# EAGLE schematic microBoard (EAGLE 6.2)

## Sheet 1 of 8: Power supplies
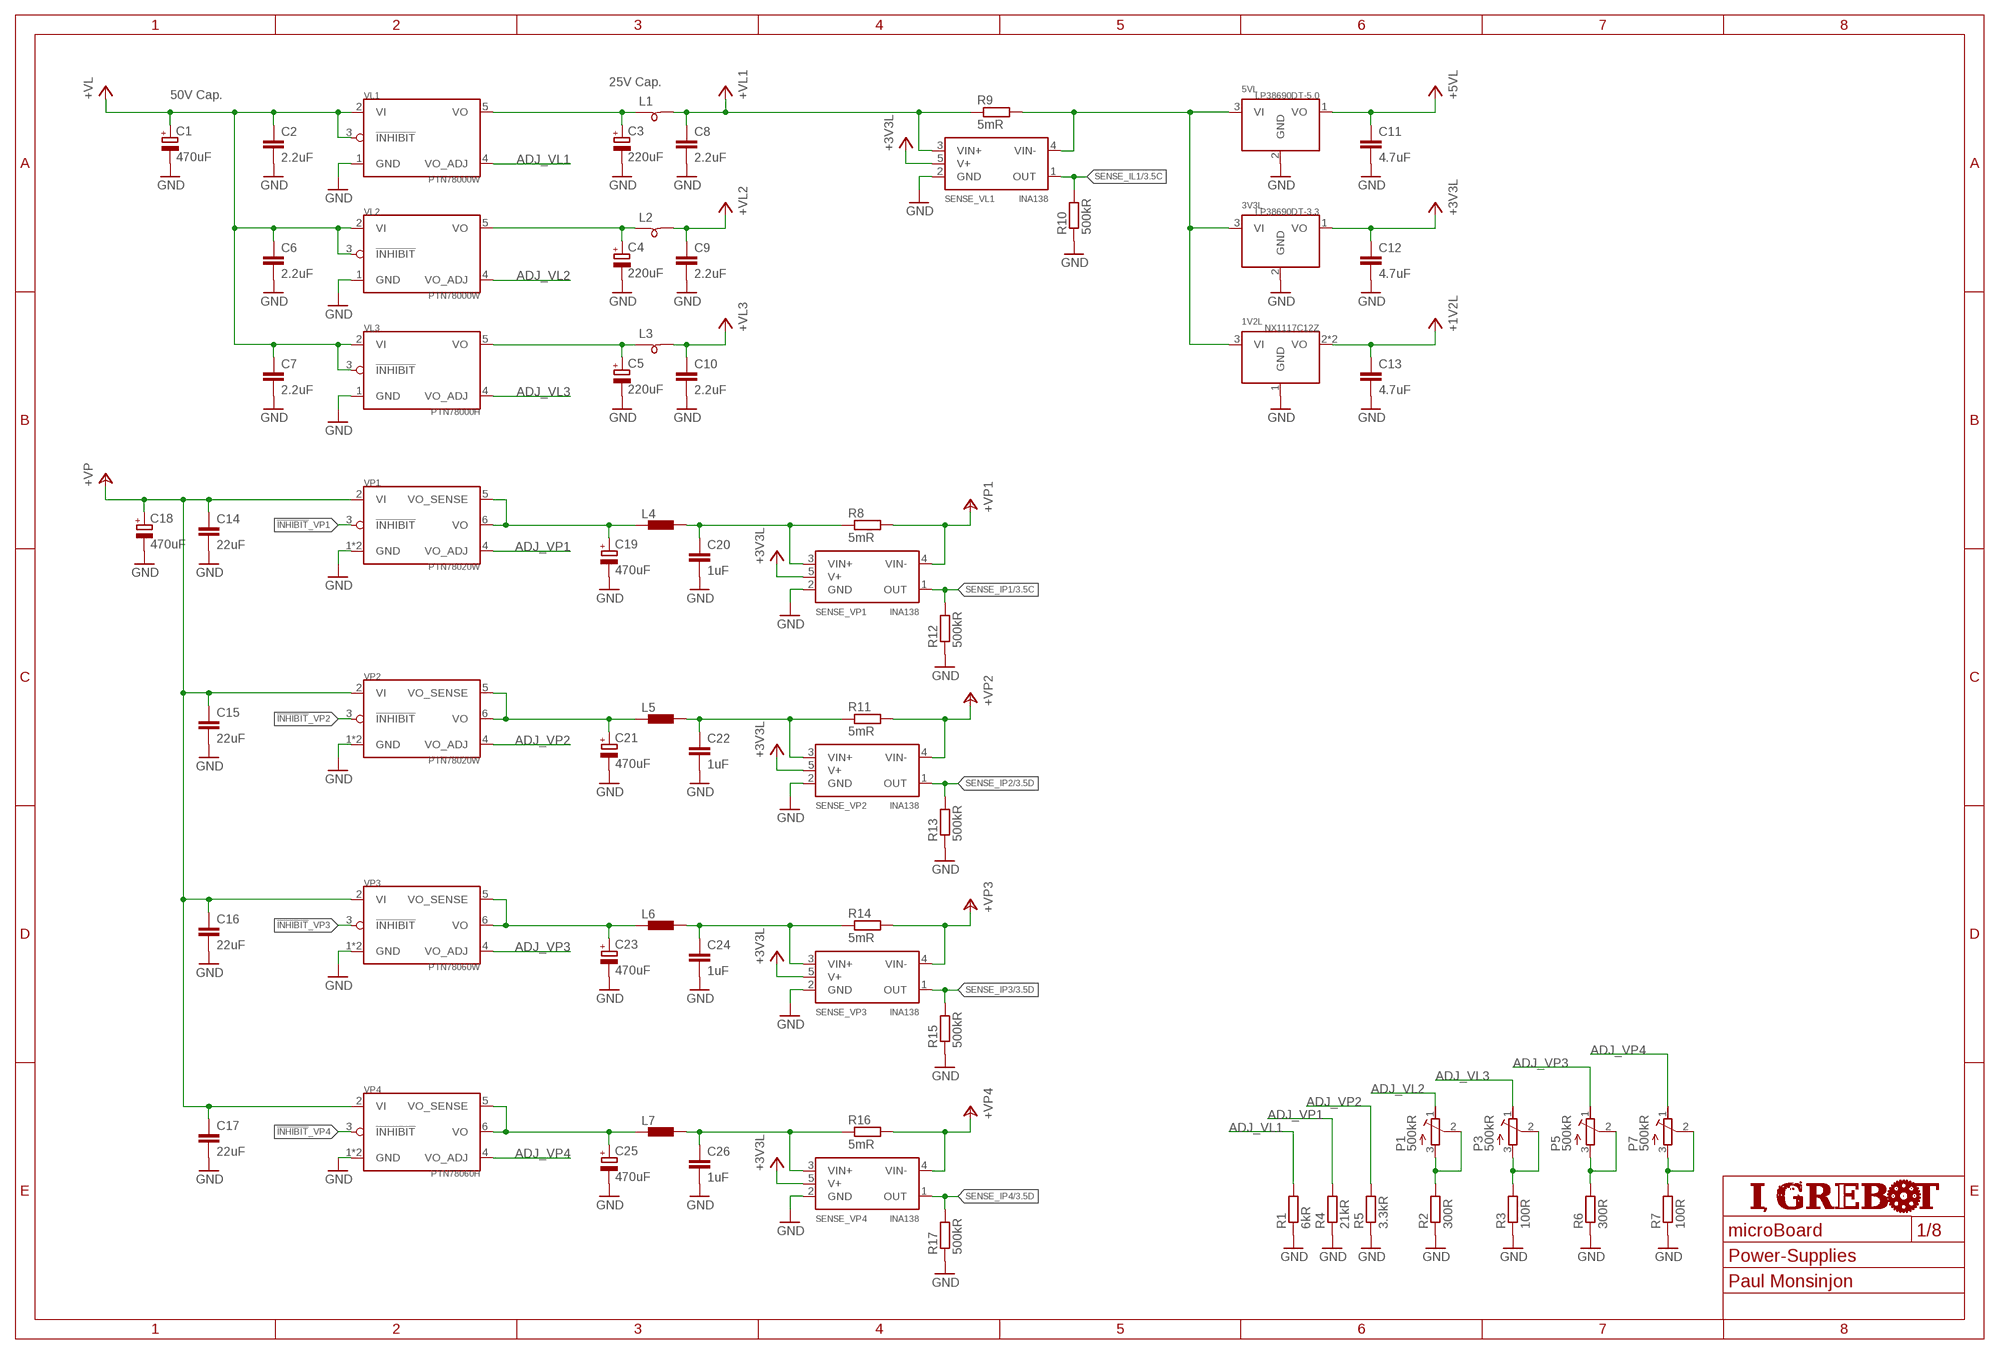
[diagram p0: schematic, sheet 1]
POWER-SUPPLIES (FRAME_A3): AUTHOR: Paul Monsinjon; SHEET_NAME: Power-Supplies

### Parts
1V2L  NX1117C12Z  NX1117C  [SOT_223]
3V3L  LP38690DT-3.3  LP38690DT  [NDP_0003B]
5VL  LP38690DT-5.0  LP38690DT  [NDP_0003B]
C1  470uF  CPOL-EUB  [PANASONIC_B]
C2  2.2uF  C-EUC3225  [C3225]
C3  220uF  CPOL-EUB  [PANASONIC_B]
C4  220uF  CPOL-EUB  [PANASONIC_B]
C5  220uF  CPOL-EUB  [PANASONIC_B]
C6  2.2uF  C-EUC3225  [C3225]
C7  2.2uF  C-EUC3225  [C3225]
C8  2.2uF  C-EUC3225  [C3225]
C9  2.2uF  C-EUC3225  [C3225]
C10  2.2uF  C-EUC3225  [C3225]
C11  4.7uF  C-EUC3225  [C3225]
C12  4.7uF  C-EUC3225  [C3225]
C13  4.7uF  C-EUC3225  [C3225]
C14  22uF  C-EUC3225  [C3225]
C15  22uF  C-EUC3225  [C3225]
C16  22uF  C-EUC3225  [C3225]
C17  22uF  C-EUC3225  [C3225]
C18  470uF  CPOL-EUB  [PANASONIC_B]
C19  470uF  CPOL-EUD  [PANASONIC_D]
C20  1uF  C-EUC3225  [C3225]
C21  470uF  CPOL-EUD  [PANASONIC_D]
C22  1uF  C-EUC3225  [C3225]
C23  470uF  CPOL-EUD  [PANASONIC_D]
C24  1uF  C-EUC3225  [C3225]
C25  470uF  CPOL-EUD  [PANASONIC_D]
C26  1uF  C-EUC3225  [C3225]
L1  SM-B9  [SM-B9]
L2  SM-B9  [SM-B9]
L3  SM-B9  [SM-B9]
L4  DR1030  [DR1030]
L5  DR1030  [DR1030]
L6  DR1030  [DR1030]
L7  DR1030  [DR1030]
P1  500kR  R-TRIMMT93XB  [RTRIMT93XB]
P3  500kR  R-TRIMMT93XB  [RTRIMT93XB]
P5  500kR  R-TRIMMT93XB  [RTRIMT93XB]
P7  500kR  R-TRIMMT93XB  [RTRIMT93XB]
R1  6kR  R-EU_R0603  [R0603]
R2  300R  R-EU_R0603  [R0603]
R3  100R  R-EU_R0603  [R0603]
R4  21kR  R-EU_R0603  [R0603]
R5  3.3kR  R-EU_R0603  [R0603]
R6  300R  R-EU_R0603  [R0603]
R7  100R  R-EU_R0603  [R0603]
R8  5mR  R-EU_R2512  [R2512]
R9  5mR  R-EU_R2512  [R2512]
R10  500kR  R-EU_R0603  [R0603]
R11  5mR  R-EU_R2512  [R2512]
R12  500kR  R-EU_R0603  [R0603]
R13  500kR  R-EU_R0603  [R0603]
R14  5mR  R-EU_R2512  [R2512]
R15  500kR  R-EU_R0603  [R0603]
R16  5mR  R-EU_R2512  [R2512]
R17  500kR  R-EU_R0603  [R0603]
SENSE_VL1  INA138  [DBV_05]
SENSE_VP1  INA138  [DBV_05]
SENSE_VP2  INA138  [DBV_05]
SENSE_VP3  INA138  [DBV_05]
SENSE_VP4  INA138  [DBV_05]
VL1  PTN78000W  [PTN78000]
VL2  PTN78000W  [PTN78000]
VL3  PTN78000H  PTN78000W  [PTN78000]
VP1  PTN78020W  [PTN78020]
VP2  PTN78020W  [PTN78020]
VP3  PTN78060W  [PTN78060]
VP4  PTN78060H  PTN78060W  [PTN78060]

### Nets
!INHIBIT!_VP1: VP1.3(!INHIBIT!)
!INHIBIT!_VP2: VP2.3(!INHIBIT!)
!INHIBIT!_VP3: VP3.3(!INHIBIT!)
!INHIBIT!_VP4: VP4.3(!INHIBIT!)
+1V2L: 1V2L.2(VO) 1V2L.4(VO) C13.1 ; also sheet 4
+3V3L: 3V3L.1(VO) C12.1 SENSE_VL1.5(V+) SENSE_VP1.5(V+) SENSE_VP2.5(V+) SENSE_VP3.5(V+) SENSE_VP4.5(V+) ; also sheet 2,3,4,5,6,7
+5VL: 5VL.1(VO) C11.1 ; also sheet 2
+VL: C1.+ C2.1 C6.1 C7.1 VL1.2(VI) VL1.3(!INHIBIT!) VL2.2(VI) VL2.3(!INHIBIT!) VL3.2(VI) VL3.3(!INHIBIT!)
+VL1: C8.1 L1.2 R9.1 SENSE_VL1.3(VIN+)
+VL2: C9.1 L2.2 ; also sheet 2
+VL3: C10.1 L3.2
+VP: C14.1 C15.1 C16.1 C17.1 C18.+ VP1.2(VI) VP2.2(VI) VP3.2(VI) VP4.2(VI) ; also sheet 5
+VP1: R8.2 SENSE_VP1.4(VIN-) ; also sheet 7
+VP2: R11.2 SENSE_VP2.4(VIN-)
+VP3: R14.2 SENSE_VP3.4(VIN-) ; also sheet 5
+VP4: R16.2 SENSE_VP4.4(VIN-) ; also sheet 5
ADJ_VL1: R1.2 VL1.4(VO_ADJ)
ADJ_VL2: P1.1(A) VL2.4(VO_ADJ)
ADJ_VL3: P3.1(A) VL3.4(VO_ADJ)
ADJ_VP1: R4.2 VP1.4(VO_ADJ)
ADJ_VP2: R5.2 VP2.4(VO_ADJ)
ADJ_VP3: P5.1(A) VP3.4(VO_ADJ)
ADJ_VP4: P7.1(A) VP4.4(VO_ADJ)
GND: 1V2L.1(GND) 3V3L.2(GND) 5VL.2(GND) C1.- C2.2 C3.- C4.- C5.- C6.2 C7.2 C8.2 C9.2 C10.2 C11.2 C12.2 C13.2 C14.2 C15.2 C16.2 C17.2 C18.- C19.- C20.2 C21.- C22.2 C23.- C24.2 C25.- C26.2 R1.1 R2.1 R3.1 R4.1 R5.1 R6.1 R7.1 R10.1 R12.1 R13.1 R15.1 R17.1 SENSE_VL1.2(GND) SENSE_VP1.2(GND) SENSE_VP2.2(GND) SENSE_VP3.2(GND) SENSE_VP4.2(GND) VL1.1(GND) VL2.1(GND) VL3.1(GND) VP1.1(GND) VP1.7(GND) VP2.1(GND) VP2.7(GND) VP3.1(GND) VP3.7(GND) VP4.1(GND) VP4.7(GND) ; also sheet 2,3,4,5,6,7
N$1: C19.+ L4.1 VP1.5(VO_SENSE) VP1.6(VO)
N$2: P1.2(S) P1.3(E) R2.2
N$3: C20.1 L4.2 R8.1 SENSE_VP1.3(VIN+)
N$4: P3.2(S) P3.3(E) R3.2
N$6: P5.2(S) P5.3(E) R6.2
N$7: C21.+ L5.1 VP2.5(VO_SENSE) VP2.6(VO)
N$8: C3.+ L1.1 VL1.5(VO)
N$9: C4.+ L2.1 VL2.5(VO)
N$10: C5.+ L3.1 VL3.5(VO)
N$11: P7.2(S) P7.3(E) R7.2
N$12: C22.1 L5.2 R11.1 SENSE_VP2.3(VIN+)
N$13: C23.+ L6.1 VP3.5(VO_SENSE) VP3.6(VO)
N$14: C24.1 L6.2 R14.1 SENSE_VP3.3(VIN+)
N$15: C25.+ L7.1 VP4.5(VO_SENSE) VP4.6(VO)
N$16: C26.1 L7.2 R16.1 SENSE_VP4.3(VIN+)
SENSE_IL1: R10.2 SENSE_VL1.1(OUT) ; also sheet 3
SENSE_IP1: R12.2 SENSE_VP1.1(OUT) ; also sheet 3
SENSE_IP2: R13.2 SENSE_VP2.1(OUT) ; also sheet 3
SENSE_IP3: R15.2 SENSE_VP3.1(OUT) ; also sheet 3
SENSE_IP4: R17.2 SENSE_VP4.1(OUT) ; also sheet 3
VS1: 1V2L.3(VI) 3V3L.3(VI) 5VL.3(VI) R9.2 SENSE_VL1.4(VIN-)

### Notes on the sheet
- 25V Cap.
- 50V Cap.

## Sheet 2 of 8: Connectors & User-Interface
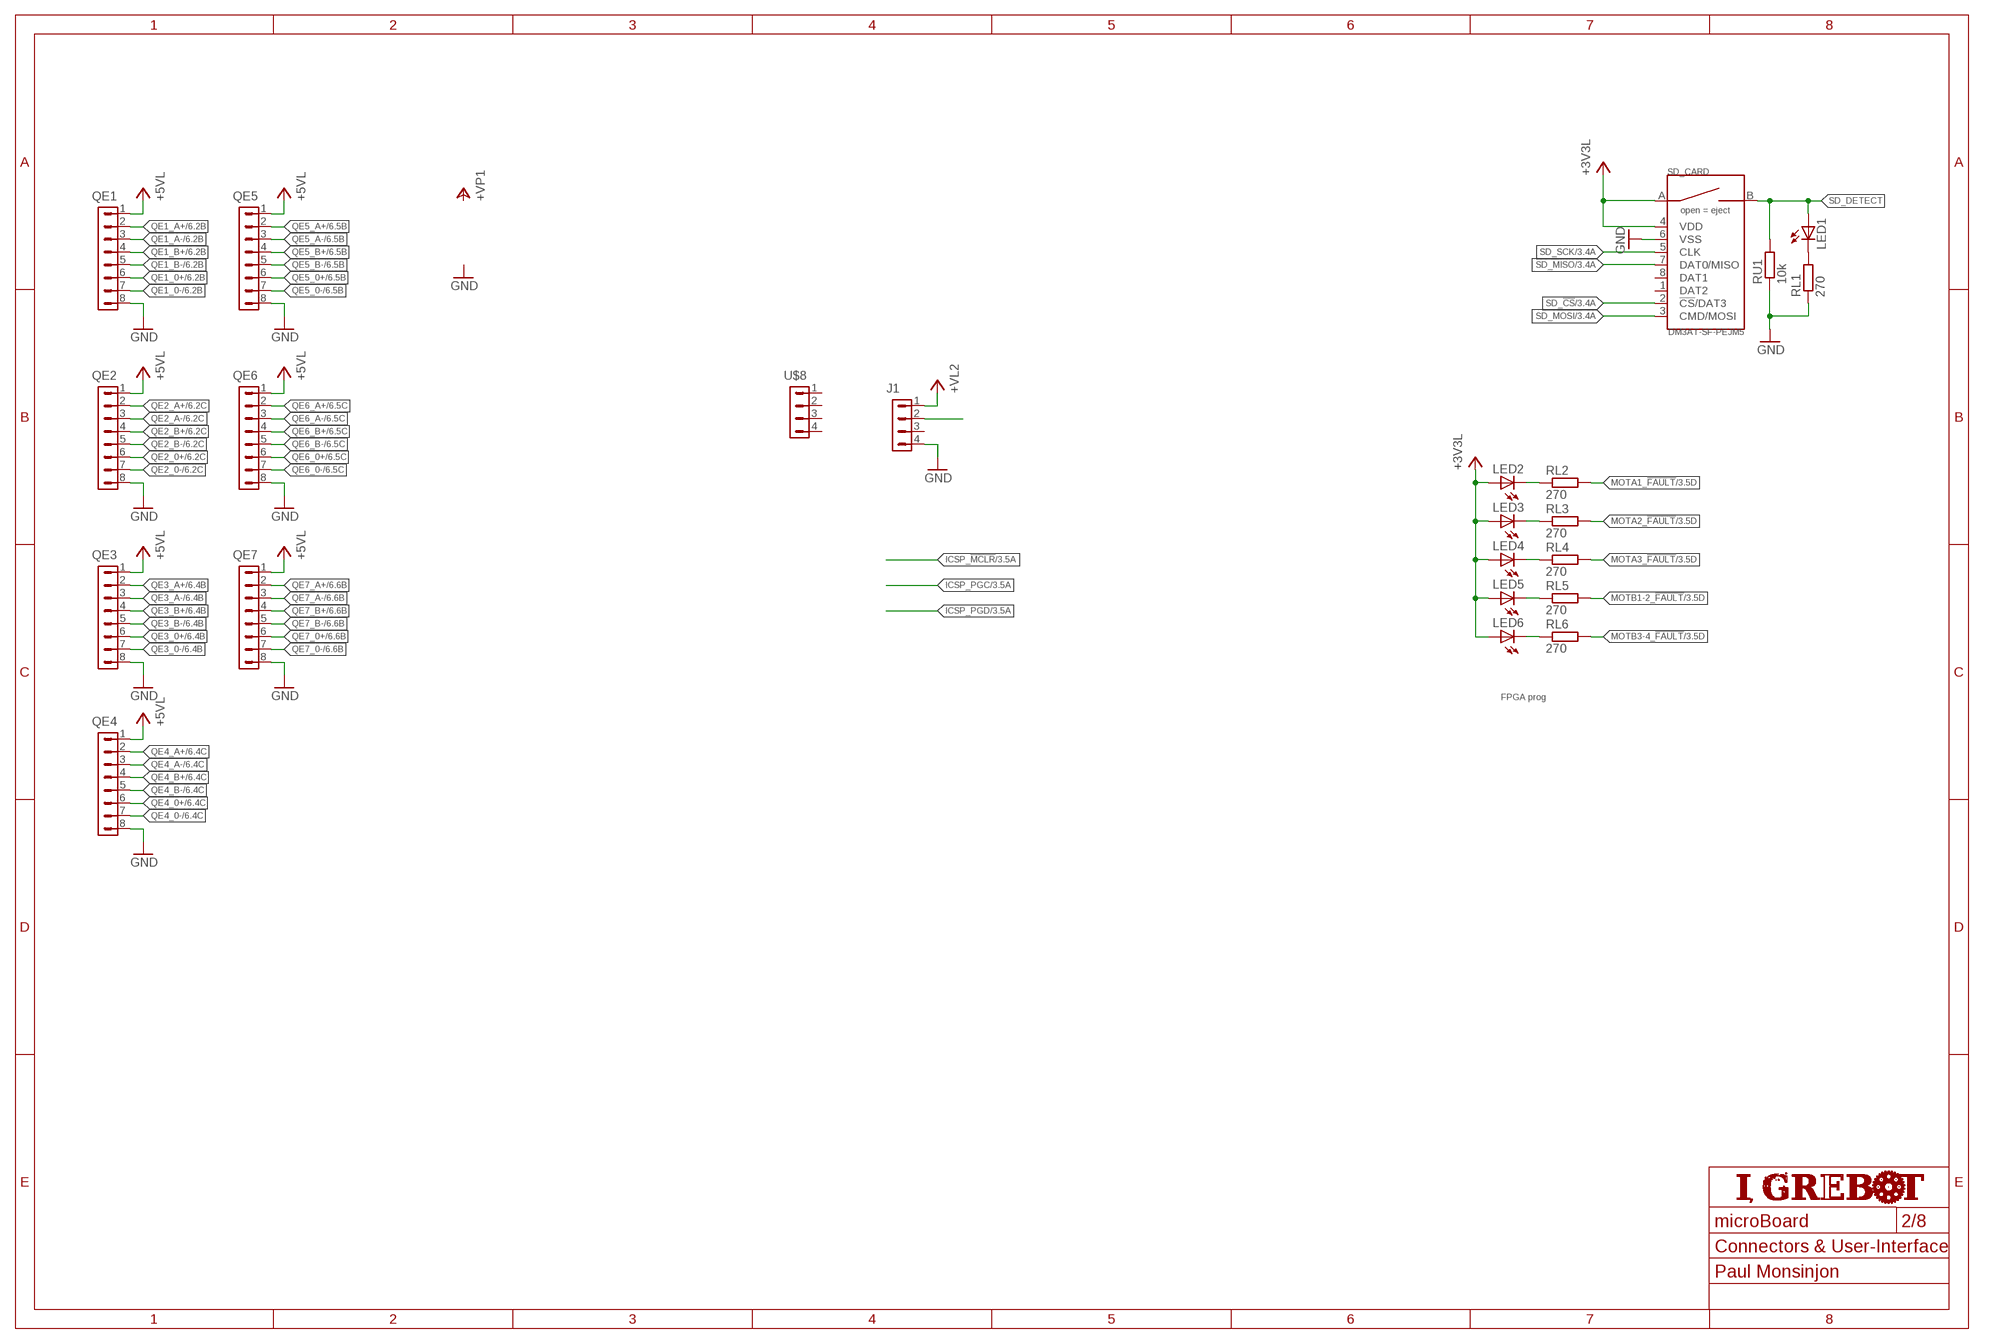
[diagram p1: schematic, sheet 2]
U$4 (FRAME_A3): AUTHOR: Paul Monsinjon; SHEET_NAME: Connectors & User-Interface

### Parts
J1  CON_1.27_4  [CON_1.27_4]
LED1  LEDCHIP-LED0805  [CHIP-LED0805]
LED2  LEDCHIP-LED0805  [CHIP-LED0805]
LED3  LEDCHIP-LED0805  [CHIP-LED0805]
LED4  LEDCHIP-LED0805  [CHIP-LED0805]
LED5  LEDCHIP-LED0805  [CHIP-LED0805]
LED6  LEDCHIP-LED0805  [CHIP-LED0805]
QE1  CON_1.27_8  [CON_1.27_8]
QE2  CON_1.27_8  [CON_1.27_8]
QE3  CON_1.27_8  [CON_1.27_8]
QE4  CON_1.27_8  [CON_1.27_8]
QE5  CON_1.27_8  [CON_1.27_8]
QE6  CON_1.27_8  [CON_1.27_8]
QE7  CON_1.27_8  [CON_1.27_8]
RL1  270  R-EU_R0603  [R0603]
RL2  270  R-EU_R0603  [R0603]
RL3  270  R-EU_R0603  [R0603]
RL4  270  R-EU_R0603  [R0603]
RL5  270  R-EU_R0603  [R0603]
RL6  270  R-EU_R0603  [R0603]
RU1  10k  R-EU_R0603  [R0603]
SD_CARD  DM3AT-SF-PEJM5  [DM3AT]
U$8  CON_1.25_4  [CON_1.25_4]

### Nets
+3V3L: LED2.A LED3.A LED4.A LED5.A LED6.A SD_CARD.4(VDD) SD_CARD.A ; also sheet 1,3,4,5,6,7
+5VL: QE1.1 QE2.1 QE3.1 QE4.1 QE5.1 QE6.1 QE7.1 ; also sheet 1
+VL2: J1.1 ; also sheet 1
GND: J1.4 QE1.8 QE2.8 QE3.8 QE4.8 QE5.8 QE6.8 QE7.8 RL1.1 RU1.1 SD_CARD.6(VSS) ; also sheet 1,3,4,5,6,7
MOTA1_!FAULT!: RL2.2 ; also sheet 3,5
MOTA2_!FAULT!: RL3.2 ; also sheet 3,5
MOTA3_!FAULT!: RL4.2 ; also sheet 3,5
MOTB1-2_!FAULT!: RL5.2 ; also sheet 3,5
MOTB3-4_!FAULT!: RL6.2 ; also sheet 3,5
N$17: LED1.C RL1.2
N$37: LED2.C RL2.1
N$39: LED3.C RL3.1
N$40: LED4.C RL4.1
N$41: LED5.C RL5.1
N$42: LED6.C RL6.1
N$51: J1.2
QE1_0+: QE1.6 ; also sheet 6
QE1_0-: QE1.7 ; also sheet 6
QE1_A+: QE1.2 ; also sheet 6
QE1_A-: QE1.3 ; also sheet 6
QE1_B+: QE1.4 ; also sheet 6
QE1_B-: QE1.5 ; also sheet 6
QE2_0+: QE2.6 ; also sheet 6
QE2_0-: QE2.7 ; also sheet 6
QE2_A+: QE2.2 ; also sheet 6
QE2_A-: QE2.3 ; also sheet 6
QE2_B+: QE2.4 ; also sheet 6
QE2_B-: QE2.5 ; also sheet 6
QE3_0+: QE3.6 ; also sheet 6
QE3_0-: QE3.7 ; also sheet 6
QE3_A+: QE3.2 ; also sheet 6
QE3_A-: QE3.3 ; also sheet 6
QE3_B+: QE3.4 ; also sheet 6
QE3_B-: QE3.5 ; also sheet 6
QE4_0+: QE4.6 ; also sheet 6
QE4_0-: QE4.7 ; also sheet 6
QE4_A+: QE4.2 ; also sheet 6
QE4_A-: QE4.3 ; also sheet 6
QE4_B+: QE4.4 ; also sheet 6
QE4_B-: QE4.5 ; also sheet 6
QE5_0+: QE5.6 ; also sheet 6
QE5_0-: QE5.7 ; also sheet 6
QE5_A+: QE5.2 ; also sheet 6
QE5_A-: QE5.3 ; also sheet 6
QE5_B+: QE5.4 ; also sheet 6
QE5_B-: QE5.5 ; also sheet 6
QE6_0+: QE6.6 ; also sheet 6
QE6_0-: QE6.7 ; also sheet 6
QE6_A+: QE6.2 ; also sheet 6
QE6_A-: QE6.3 ; also sheet 6
QE6_B+: QE6.4 ; also sheet 6
QE6_B-: QE6.5 ; also sheet 6
QE7_0+: QE7.6 ; also sheet 6
QE7_0-: QE7.7 ; also sheet 6
QE7_A+: QE7.2 ; also sheet 6
QE7_A-: QE7.3 ; also sheet 6
QE7_B+: QE7.4 ; also sheet 6
QE7_B-: QE7.5 ; also sheet 6
SD_!CS!: SD_CARD.2(!CS!/DAT3) ; also sheet 3
SD_DETECT: LED1.A RU1.2 SD_CARD.B
SD_MISO: SD_CARD.7(DAT0/MISO) ; also sheet 3
SD_MOSI: SD_CARD.3(CMD/MOSI) ; also sheet 3
SD_SCK: SD_CARD.5(CLK) ; also sheet 3
Unconnected: J1.3 SD_CARD.1(DAT2) SD_CARD.8(DAT1) U$8.1 U$8.2 U$8.3 U$8.4

### Notes on the sheet
- FPGA prog

## Sheet 3 of 8: µC dsPIC33E
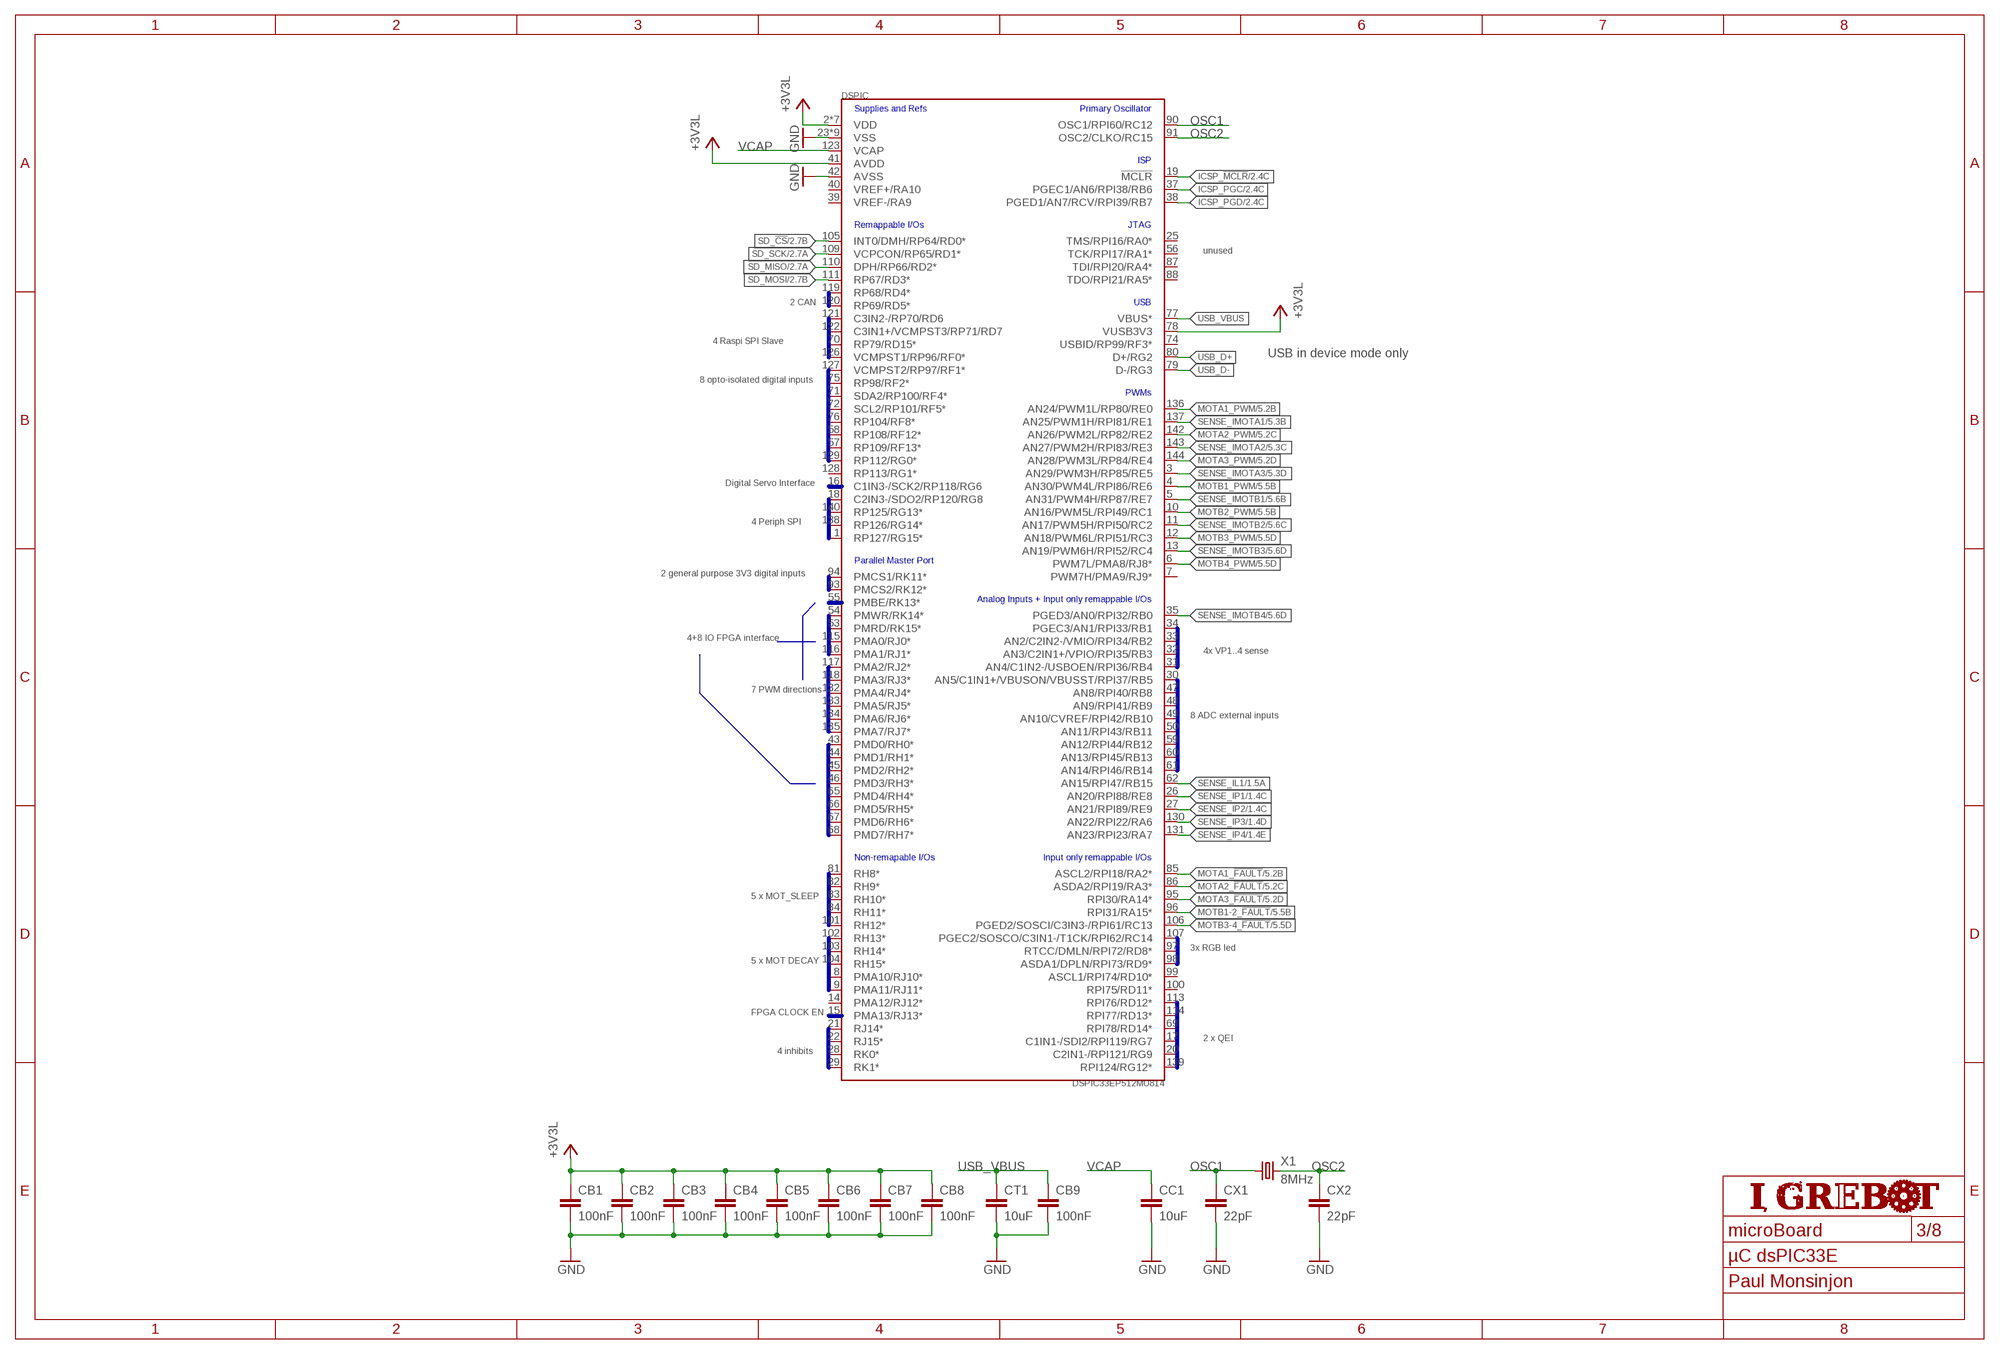
[diagram p2: schematic, sheet 3]
U$2 (FRAME_A3): AUTHOR: Paul Monsinjon; SHEET_NAME: µC dsPIC33E

### Parts
CB1  100nF  C-EUC0603  [C0603]
CB2  100nF  C-EUC0603  [C0603]
CB3  100nF  C-EUC0603  [C0603]
CB4  100nF  C-EUC0603  [C0603]
CB5  100nF  C-EUC0603  [C0603]
CB6  100nF  C-EUC0603  [C0603]
CB7  100nF  C-EUC0603  [C0603]
CB8  100nF  C-EUC0603  [C0603]
CB9  100nF  C-EUC0603  [C0603]
CC1  10uF  C-EUC1210  [C1210]
CT1  10uF  C-EUC1210  [C1210]
CX1  22pF  C-EUC0603  [C0603]
CX2  22pF  C-EUC0603  [C0603]
DSPIC  DSPIC33EP512MU814  [TQFP_144]
X1  8MHz  CRYSTALCTS406  [CTS406]

### Nets
+3V3L: CB1.1 CB2.1 CB3.1 CB4.1 CB5.1 CB6.1 CB7.1 CB8.1 DSPIC.2(VDD) DSPIC.24(VDD) DSPIC.41(AVDD) DSPIC.52(VDD) DSPIC.64(VDD) DSPIC.78(VUSB3V3) DSPIC.89(VDD) DSPIC.112(VDD) DSPIC.124(VDD) ; also sheet 1,2,4,5,6,7
GND: CB1.2 CB2.2 CB3.2 CB4.2 CB5.2 CB6.2 CB7.2 CB8.2 CB9.2 CC1.2 CT1.2 CX1.2 CX2.2 DSPIC.23(VSS) DSPIC.36(VSS) DSPIC.42(AVSS) DSPIC.51(VSS) DSPIC.63(VSS) DSPIC.73(VSS) DSPIC.92(VSS) DSPIC.108(VSS) DSPIC.125(VSS) DSPIC.141(VSS) ; also sheet 1,2,4,5,6,7
ICSP_!MCLR!: DSPIC.19(!MCLR!) ; also sheet 2
ICSP_PGC: DSPIC.37(PGEC1/AN6/RPI38/RB6) ; also sheet 2
ICSP_PGD: DSPIC.38(PGED1/AN7/RCV/RPI39/RB7) ; also sheet 2
MOTA1_!FAULT!: DSPIC.85(ASCL2/RPI18/RA2*) ; also sheet 2,5
MOTA1_PWM: DSPIC.136(AN24/PWM1L/RP80/RE0) ; also sheet 5
MOTA2_!FAULT!: DSPIC.86(ASDA2/RPI19/RA3*) ; also sheet 2,5
MOTA2_PWM: DSPIC.142(AN26/PWM2L/RP82/RE2) ; also sheet 5
MOTA3_!FAULT!: DSPIC.95(RPI30/RA14*) ; also sheet 2,5
MOTA3_PWM: DSPIC.144(AN28/PWM3L/RP84/RE4) ; also sheet 5
MOTB1-2_!FAULT!: DSPIC.96(RPI31/RA15*) ; also sheet 2,5
MOTB1_PWM: DSPIC.4(AN30/PWM4L/RPI86/RE6) ; also sheet 5
MOTB2_PWM: DSPIC.10(AN16/PWM5L/RPI49/RC1) ; also sheet 5
MOTB3-4_!FAULT!: DSPIC.106(PGED2/SOSCI/C3IN3-/RPI61/RC13) ; also sheet 2,5
MOTB3_PWM: DSPIC.12(AN18/PWM6L/RPI51/RC3) ; also sheet 5
MOTB4_PWM: DSPIC.6(PWM7L/PMA8/RJ8*) ; also sheet 5
OSC1: CX1.1 DSPIC.90(OSC1/RPI60/RC12) X1.1
OSC2: CX2.1 DSPIC.91(OSC2/CLKO/RC15) X1.3
SD_!CS!: DSPIC.105(INT0/DMH/RP64/RD0*) ; also sheet 2
SD_MISO: DSPIC.110(DPH/RP66/RD2*) ; also sheet 2
SD_MOSI: DSPIC.111(RP67/RD3*) ; also sheet 2
SD_SCK: DSPIC.109(VCPCON/RP65/RD1*) ; also sheet 2
SENSE_IL1: DSPIC.62(AN15/RPI47/RB15) ; also sheet 1
SENSE_IMOTA1: DSPIC.137(AN25/PWM1H/RPI81/RE1) ; also sheet 5
SENSE_IMOTA2: DSPIC.143(AN27/PWM2H/RPI83/RE3) ; also sheet 5
SENSE_IMOTA3: DSPIC.3(AN29/PWM3H/RP85/RE5) ; also sheet 5
SENSE_IMOTB1: DSPIC.5(AN31/PWM4H/RP87/RE7) ; also sheet 5
SENSE_IMOTB2: DSPIC.11(AN17/PWM5H/RPI50/RC2) ; also sheet 5
SENSE_IMOTB3: DSPIC.13(AN19/PWM6H/RPI52/RC4) ; also sheet 5
SENSE_IMOTB4: DSPIC.35(PGED3/AN0/RPI32/RB0) ; also sheet 5
SENSE_IP1: DSPIC.26(AN20/RPI88/RE8) ; also sheet 1
SENSE_IP2: DSPIC.27(AN21/RPI89/RE9) ; also sheet 1
SENSE_IP3: DSPIC.130(AN22/RPI22/RA6) ; also sheet 1
SENSE_IP4: DSPIC.131(AN23/RPI23/RA7) ; also sheet 1
USB_D+: DSPIC.80(D+/RG2)
USB_D-: DSPIC.79(D-/RG3)
USB_VBUS: CB9.1 CT1.1 DSPIC.77(VBUS*)
VCAP: CC1.1 DSPIC.123(VCAP)
Unconnected: DSPIC.1(RP127/RG15*) DSPIC.7(PWM7H/PMA9/RJ9*) DSPIC.8(PMA10/RJ10*) DSPIC.9(PMA11/RJ11*) DSPIC.14(PMA12/RJ12*) DSPIC.15(PMA13/RJ13*) DSPIC.16(C1IN3-/SCK2/RP118/RG6) DSPIC.17(C1IN1-/SDI2/RPI119/RG7) DSPIC.18(C2IN3-/SDO2/RP120/RG8) DSPIC.20(C2IN1-/RPI121/RG9) DSPIC.21(RJ14*) DSPIC.22(RJ15*) DSPIC.25(TMS/RPI16/RA0*) DSPIC.28(RK0*) DSPIC.29(RK1*) DSPIC.30(AN5/C1IN1+/VBUSON/VBUSST/RPI37/RB5) DSPIC.31(AN4/C1IN2-/USBOEN/RPI36/RB4) DSPIC.32(AN3/C2IN1+/VPIO/RPI35/RB3) DSPIC.33(AN2/C2IN2-/VMIO/RPI34/RB2) DSPIC.34(PGEC3/AN1/RPI33/RB1) DSPIC.39(VREF-/RA9) DSPIC.40(VREF+/RA10) DSPIC.43(PMD0/RH0*) DSPIC.44(PMD1/RH1*) DSPIC.45(PMD2/RH2*) DSPIC.46(PMD3/RH3*) DSPIC.47(AN8/RPI40/RB8) DSPIC.48(AN9/RPI41/RB9) DSPIC.49(AN10/CVREF/RPI42/RB10) DSPIC.50(AN11/RPI43/RB11) DSPIC.53(PMRD/RK15*) DSPIC.54(PMWR/RK14*) DSPIC.55(PMBE/RK13*) DSPIC.56(TCK/RPI17/RA1*) DSPIC.57(RP109/RF13*) DSPIC.58(RP108/RF12*) DSPIC.59(AN12/RPI44/RB12) DSPIC.60(AN13/RPI45/RB13) DSPIC.61(AN14/RPI46/RB14) DSPIC.65(PMD4/RH4*) DSPIC.66(PMD5/RH5*) DSPIC.67(PMD6/RH6*) DSPIC.68(PMD7/RH7*) DSPIC.69(RPI78/RD14*) DSPIC.70(RP79/RD15*) DSPIC.71(SDA2/RP100/RF4*) DSPIC.72(SCL2/RP101/RF5*) DSPIC.74(USBID/RP99/RF3*) DSPIC.75(RP98/RF2*) DSPIC.76(RP104/RF8*) DSPIC.81(RH8*) DSPIC.82(RH9*) DSPIC.83(RH10*) DSPIC.84(RH11*) DSPIC.87(TDI/RPI20/RA4*) DSPIC.88(TDO/RPI21/RA5*) DSPIC.93(PMCS2/RK12*) DSPIC.94(PMCS1/RK11*) DSPIC.97(RTCC/DMLN/RPI72/RD8*) DSPIC.98(ASDA1/DPLN/RPI73/RD9*) DSPIC.99(ASCL1/RPI74/RD10*) DSPIC.100(RPI75/RD11*) DSPIC.101(RH12*) DSPIC.102(RH13*) DSPIC.103(RH14*) DSPIC.104(RH15*) DSPIC.107(PGEC2/SOSCO/C3IN1-/T1CK/RPI62/RC14) DSPIC.113(RPI76/RD12*) DSPIC.114(RPI77/RD13*) DSPIC.115(PMA0/RJ0*) DSPIC.116(PMA1/RJ1*) DSPIC.117(PMA2/RJ2*) DSPIC.118(PMA3/RJ3*) DSPIC.119(RP68/RD4*) DSPIC.120(RP69/RD5*) DSPIC.121(C3IN2-/RP70/RD6) DSPIC.122(C3IN1+/VCMPST3/RP71/RD7) DSPIC.126(VCMPST1/RP96/RF0*) DSPIC.127(VCMPST2/RP97/RF1*) DSPIC.128(RP113/RG1*) DSPIC.129(RP112/RG0*) DSPIC.132(PMA4/RJ4*) DSPIC.133(PMA5/RJ5*) DSPIC.134(PMA6/RJ6*) DSPIC.135(PMA7/RJ7*) DSPIC.138(RP126/RG14*) DSPIC.139(RPI124/RG12*) DSPIC.140(RP125/RG13*)

### Buses
B$3
B$5
B$8
B$9
B$11
B$12
B$13
B$14
B$16
B$6
B$17
B$18
B$10
B$19
B$7
B$15
B$20
B$21
B$22
B$23

### Notes on the sheet
- unused
- 2 CAN
- 4 Raspi SPI Slave
- USB in device mode only
- 8 opto-isolated digital inputs
- Digital Servo Interface
- 4 Periph SPI
- 2 general purpose 3V3 digital inputs
- 4+8 IO FPGA interface
- 4x VP1..4 sense
- 7 PWM directions
- 8 ADC external inputs
- 5 x MOT_SLEEP
- 3x RGB led
- 5 x MOT DECAY
- FPGA CLOCK EN
- 2 x QEI
- 4 inhibits

## Sheet 4 of 8: FPGA XC3S200A
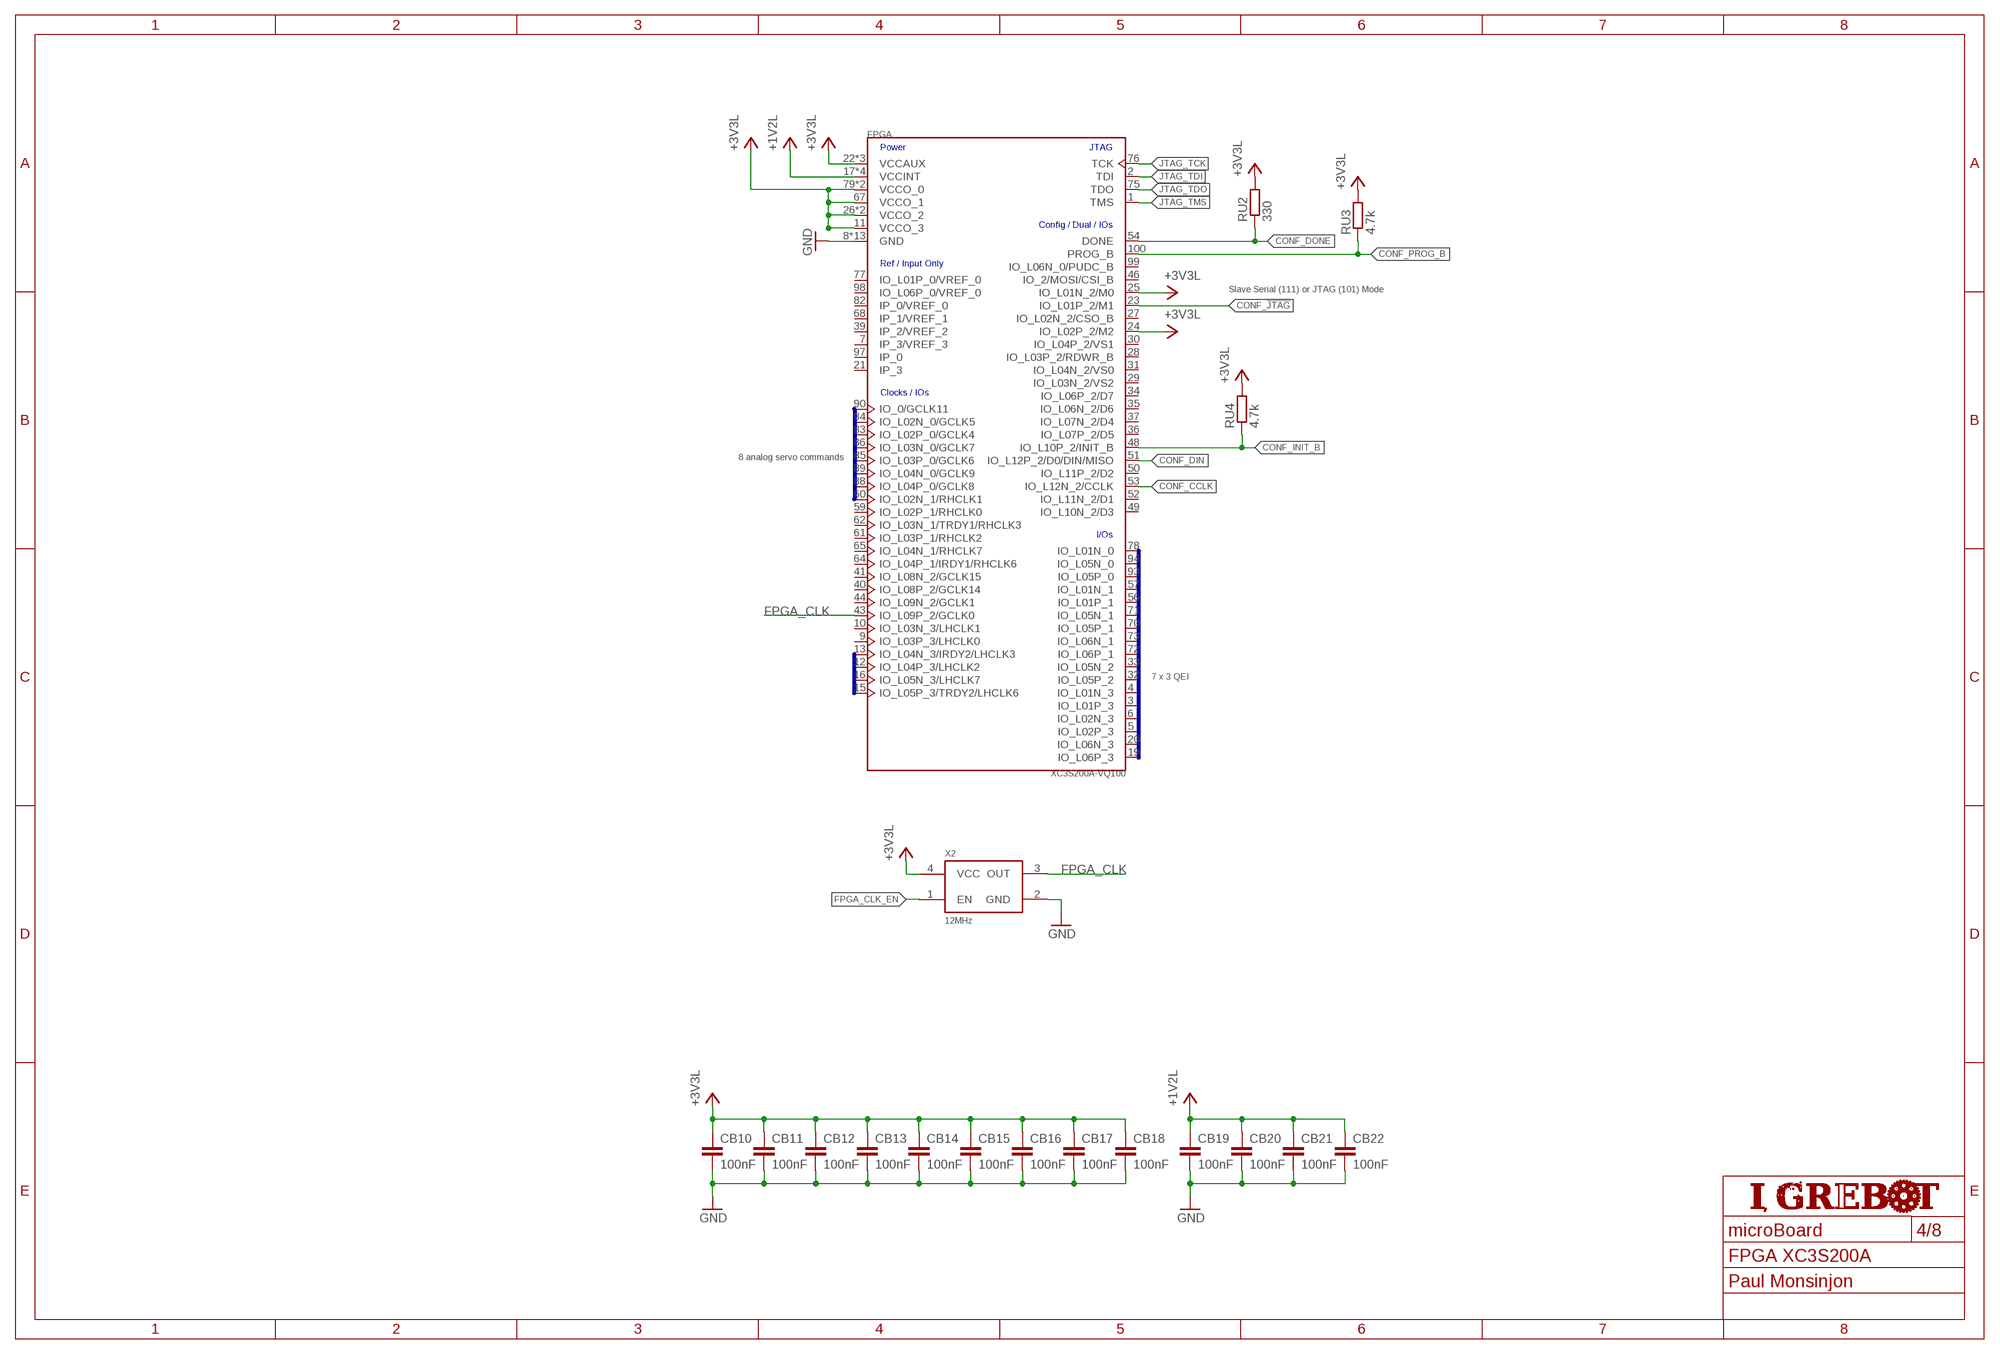
[diagram p3: schematic, sheet 4]
U$3 (FRAME_A3): AUTHOR: Paul Monsinjon; SHEET_NAME: FPGA XC3S200A

### Parts
CB10  100nF  C-EUC0603  [C0603]
CB11  100nF  C-EUC0603  [C0603]
CB12  100nF  C-EUC0603  [C0603]
CB13  100nF  C-EUC0603  [C0603]
CB14  100nF  C-EUC0603  [C0603]
CB15  100nF  C-EUC0603  [C0603]
CB16  100nF  C-EUC0603  [C0603]
CB17  100nF  C-EUC0603  [C0603]
CB18  100nF  C-EUC0603  [C0603]
CB19  100nF  C-EUC0603  [C0603]
CB20  100nF  C-EUC0603  [C0603]
CB21  100nF  C-EUC0603  [C0603]
CB22  100nF  C-EUC0603  [C0603]
FPGA  XC3S200A-VQ100  [VQFP_100]
RU2  330  R-EU_R0603  [R0603]
RU3  4.7k  R-EU_R0603  [R0603]
RU4  4.7k  R-EU_R0603  [R0603]
X2  12MHz  OSCILLATOR5X3  [CRYSTAL-SMD-5X3]

### Nets
+1V2L: CB19.1 CB20.1 CB21.1 CB22.1 FPGA.17(VCCINT) FPGA.38(VCCINT) FPGA.66(VCCINT) FPGA.81(VCCINT) ; also sheet 1
+3V3L: CB10.1 CB11.1 CB12.1 CB13.1 CB14.1 CB15.1 CB16.1 CB17.1 CB18.1 FPGA.11(VCCO_3) FPGA.22(VCCAUX) FPGA.24(IO_L02P_2/M2) FPGA.25(IO_L01N_2/M0) FPGA.26(VCCO_2) FPGA.45(VCCO_2) FPGA.55(VCCAUX) FPGA.67(VCCO_1) FPGA.79(VCCO_0) FPGA.92(VCCAUX) FPGA.96(VCCO_0) RU2.2 RU3.2 RU4.2 X2.4(VCC) ; also sheet 1,2,3,5,6,7
CONF_!JTAG!: FPGA.23(IO_L01P_2/M1)
CONF_CCLK: FPGA.53(IO_L12N_2/CCLK)
CONF_DIN: FPGA.51(IO_L12P_2/D0/DIN/MISO)
CONF_DONE: FPGA.54(DONE) RU2.1
CONF_INIT_B: FPGA.48(IO_L10P_2/INIT_B) RU4.1
CONF_PROG_B: FPGA.100(PROG_B) RU3.1
FPGA_CLK: FPGA.43(IO_L09P_2/GCLK0) X2.3(OUT)
FPGA_CLK_EN: X2.1(EN)
GND: CB10.2 CB11.2 CB12.2 CB13.2 CB14.2 CB15.2 CB16.2 CB17.2 CB18.2 CB19.2 CB20.2 CB21.2 CB22.2 FPGA.8(GND) FPGA.14(GND) FPGA.18(GND) FPGA.42(GND) FPGA.47(GND) FPGA.58(GND) FPGA.63(GND) FPGA.69(GND) FPGA.74(GND) FPGA.80(GND) FPGA.87(GND) FPGA.91(GND) FPGA.95(GND) X2.2(GND) ; also sheet 1,2,3,5,6,7
JTAG_TCK: FPGA.76(TCK)
JTAG_TDI: FPGA.2(TDI)
JTAG_TDO: FPGA.75(TDO)
JTAG_TMS: FPGA.1(TMS)
Unconnected: FPGA.3(IO_L01P_3) FPGA.4(IO_L01N_3) FPGA.5(IO_L02P_3) FPGA.6(IO_L02N_3) FPGA.7(IP_3/VREF_3) FPGA.9(IO_L03P_3/LHCLK0) FPGA.10(IO_L03N_3/LHCLK1) FPGA.12(IO_L04P_3/LHCLK2) FPGA.13(IO_L04N_3/IRDY2/LHCLK3) FPGA.15(IO_L05P_3/TRDY2/LHCLK6) FPGA.16(IO_L05N_3/LHCLK7) FPGA.19(IO_L06P_3) FPGA.20(IO_L06N_3) FPGA.21(IP_3) FPGA.27(IO_L02N_2/CSO_B) FPGA.28(IO_L03P_2/RDWR_B) FPGA.29(IO_L03N_2/VS2) FPGA.30(IO_L04P_2/VS1) FPGA.31(IO_L04N_2/VS0) FPGA.32(IO_L05P_2) FPGA.33(IO_L05N_2) FPGA.34(IO_L06P_2/D7) FPGA.35(IO_L06N_2/D6) FPGA.36(IO_L07P_2/D5) FPGA.37(IO_L07N_2/D4) FPGA.39(IP_2/VREF_2) FPGA.40(IO_L08P_2/GCLK14) FPGA.41(IO_L08N_2/GCLK15) FPGA.44(IO_L09N_2/GCLK1) FPGA.46(IO_2/MOSI/CSI_B) FPGA.49(IO_L10N_2/D3) FPGA.50(IO_L11P_2/D2) FPGA.52(IO_L11N_2/D1) FPGA.56(IO_L01P_1) FPGA.57(IO_L01N_1) FPGA.59(IO_L02P_1/RHCLK0) FPGA.60(IO_L02N_1/RHCLK1) FPGA.61(IO_L03P_1/RHCLK2) FPGA.62(IO_L03N_1/TRDY1/RHCLK3) FPGA.64(IO_L04P_1/IRDY1/RHCLK6) FPGA.65(IO_L04N_1/RHCLK7) FPGA.68(IP_1/VREF_1) FPGA.70(IO_L05P_1) FPGA.71(IO_L05N_1) FPGA.72(IO_L06P_1) FPGA.73(IO_L06N_1) FPGA.77(IO_L01P_0/VREF_0) FPGA.78(IO_L01N_0) FPGA.82(IP_0/VREF_0) FPGA.83(IO_L02P_0/GCLK4) FPGA.84(IO_L02N_0/GCLK5) FPGA.85(IO_L03P_0/GCLK6) FPGA.86(IO_L03N_0/GCLK7) FPGA.88(IO_L04P_0/GCLK8) FPGA.89(IO_L04N_0/GCLK9) FPGA.90(IO_0/GCLK11) FPGA.93(IO_L05P_0) FPGA.94(IO_L05N_0) FPGA.97(IP_0) FPGA.98(IO_L06P_0/VREF_0) FPGA.99(IO_L06N_0/PUDC_B)

### Buses
B$1
B$2
B$4

### Notes on the sheet
- Slave Serial (111) or JTAG (101) Mode
- 8 analog servo commands
- 7 x 3 QEI

## Sheet 5 of 8: H-Bridges
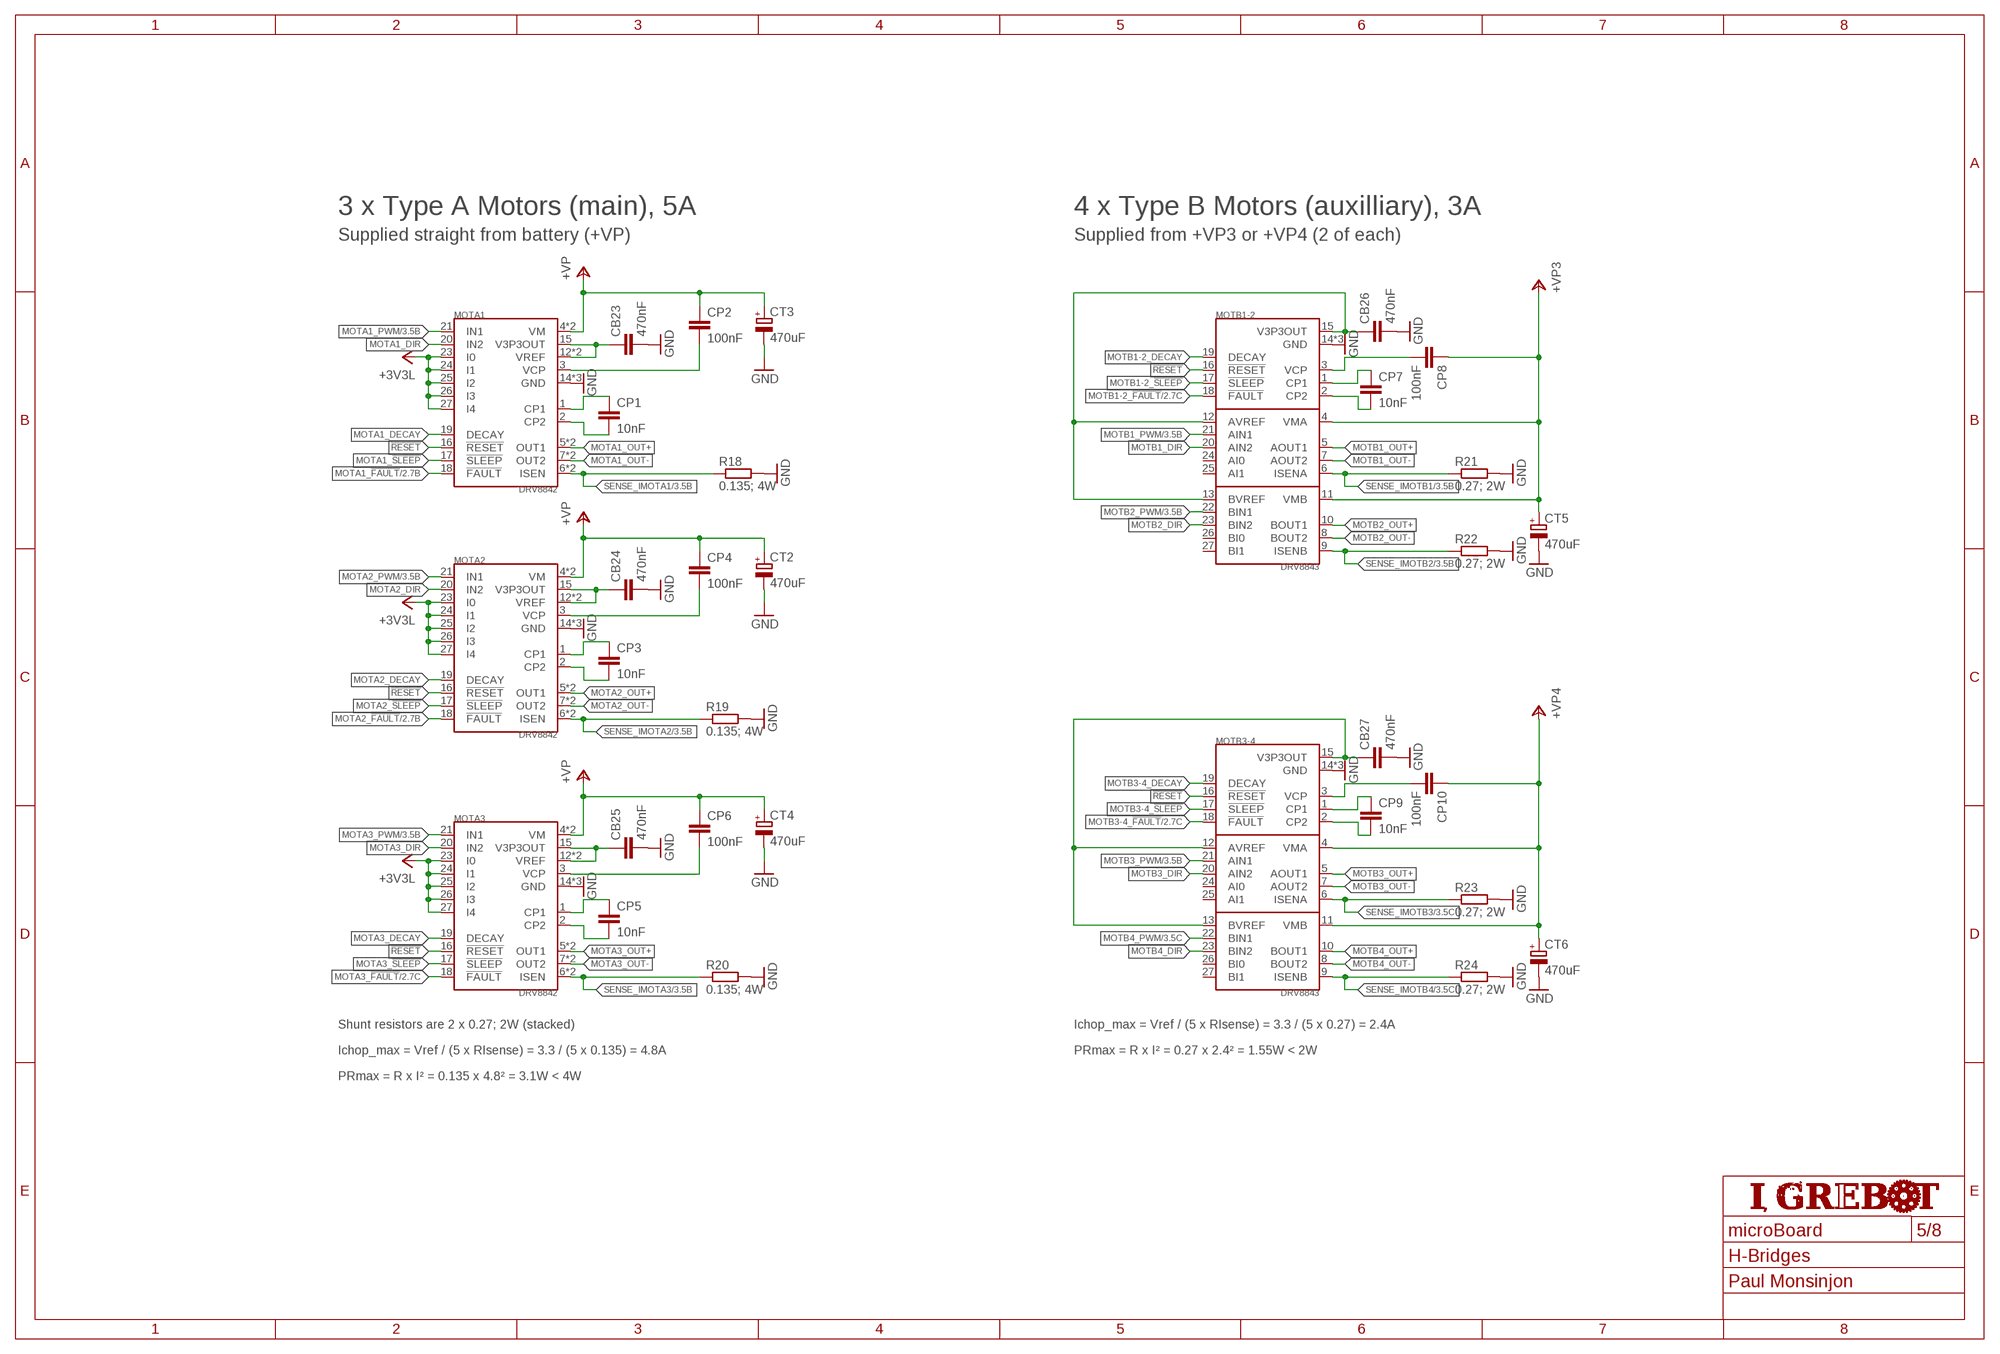
[diagram p4: schematic, sheet 5]
U$5 (FRAME_A3): AUTHOR: Paul Monsinjon; SHEET_NAME: H-Bridges

### Parts
CB23  470nF  C-EUC0603  [C0603]
CB24  470nF  C-EUC0603  [C0603]
CB25  470nF  C-EUC0603  [C0603]
CB26  470nF  C-EUC0603  [C0603]
CB27  470nF  C-EUC0603  [C0603]
CP1  10nF  C-EUC0603  [C0603]
CP2  100nF  C-EUC0603  [C0603]
CP3  10nF  C-EUC0603  [C0603]
CP4  100nF  C-EUC0603  [C0603]
CP5  10nF  C-EUC0603  [C0603]
CP6  100nF  C-EUC0603  [C0603]
CP7  10nF  C-EUC0603  [C0603]
CP8  100nF  C-EUC0603  [C0603]
CP9  10nF  C-EUC0603  [C0603]
CP10  100nF  C-EUC0603  [C0603]
CT2  470uF  CPOL-EUD  [PANASONIC_D]
CT3  470uF  CPOL-EUD  [PANASONIC_D]
CT4  470uF  CPOL-EUD  [PANASONIC_D]
CT5  470uF  CPOL-EUD  [PANASONIC_D]
CT6  470uF  CPOL-EUD  [PANASONIC_D]
MOTA1  DRV8842  [PWP_28]
MOTA2  DRV8842  [PWP_28]
MOTA3  DRV8842  [PWP_28]
MOTB1-2  DRV8843  [PWP_28]
MOTB3-4  DRV8843  [PWP_28]
R18  0.135; 4W  R-EU_R2512  [R2512]
R19  0.135; 4W  R-EU_R2512  [R2512]
R20  0.135; 4W  R-EU_R2512  [R2512]
R21  0.27; 2W  R-EU_R2512  [R2512]
R22  0.27; 2W  R-EU_R2512  [R2512]
R23  0.27; 2W  R-EU_R2512  [R2512]
R24  0.27; 2W  R-EU_R2512  [R2512]

### Nets
!RESET!: MOTA1.16(!RESET!) MOTA2.16(!RESET!) MOTA3.16(!RESET!) MOTB1-2.16(!RESET!) MOTB3-4.16(!RESET!)
+3V3L: MOTA1.23(I0) MOTA1.24(I1) MOTA1.25(I2) MOTA1.26(I3) MOTA1.27(I4) MOTA2.23(I0) MOTA2.24(I1) MOTA2.25(I2) MOTA2.26(I3) MOTA2.27(I4) MOTA3.23(I0) MOTA3.24(I1) MOTA3.25(I2) MOTA3.26(I3) MOTA3.27(I4) ; also sheet 1,2,3,4,6,7
+VP: CP2.1 CP4.1 CP6.1 CT2.+ CT3.+ CT4.+ MOTA1.4(VM) MOTA1.11(VM) MOTA2.4(VM) MOTA2.11(VM) MOTA3.4(VM) MOTA3.11(VM) ; also sheet 1
+VP3: CP8.1 CT5.+ MOTB1-2.4(VMA) MOTB1-2.11(VMB) ; also sheet 1
+VP4: CP10.1 CT6.+ MOTB3-4.4(VMA) MOTB3-4.11(VMB) ; also sheet 1
GND: CB23.2 CB24.2 CB25.2 CB26.2 CB27.2 CT2.- CT3.- CT4.- CT5.- CT6.- MOTA1.14(GND) MOTA1.28(GND) MOTA1.PPAD(GND) MOTA2.14(GND) MOTA2.28(GND) MOTA2.PPAD(GND) MOTA3.14(GND) MOTA3.28(GND) MOTA3.PPAD(GND) MOTB1-2.14(GND) MOTB1-2.28(GND) MOTB1-2.PPAD(GND) MOTB3-4.14(GND) MOTB3-4.28(GND) MOTB3-4.PPAD(GND) R18.2 R19.2 R20.2 R21.2 R22.2 R23.2 R24.2 ; also sheet 1,2,3,4,6,7
MOTA1_!FAULT!: MOTA1.18(!FAULT!) ; also sheet 2,3
MOTA1_!SLEEP!: MOTA1.17(!SLEEP!)
MOTA1_DECAY: MOTA1.19(DECAY)
MOTA1_DIR: MOTA1.20(IN2)
MOTA1_OUT+: MOTA1.5(OUT1) MOTA1.10(OUT1)
MOTA1_OUT-: MOTA1.7(OUT2) MOTA1.8(OUT2)
MOTA1_PWM: MOTA1.21(IN1) ; also sheet 3
MOTA2_!FAULT!: MOTA2.18(!FAULT!) ; also sheet 2,3
MOTA2_!SLEEP!: MOTA2.17(!SLEEP!)
MOTA2_DECAY: MOTA2.19(DECAY)
MOTA2_DIR: MOTA2.20(IN2)
MOTA2_OUT+: MOTA2.5(OUT1) MOTA2.10(OUT1)
MOTA2_OUT-: MOTA2.7(OUT2) MOTA2.8(OUT2)
MOTA2_PWM: MOTA2.21(IN1) ; also sheet 3
MOTA3_!FAULT!: MOTA3.18(!FAULT!) ; also sheet 2,3
MOTA3_!SLEEP!: MOTA3.17(!SLEEP!)
MOTA3_DECAY: MOTA3.19(DECAY)
MOTA3_DIR: MOTA3.20(IN2)
MOTA3_OUT+: MOTA3.5(OUT1) MOTA3.10(OUT1)
MOTA3_OUT-: MOTA3.7(OUT2) MOTA3.8(OUT2)
MOTA3_PWM: MOTA3.21(IN1) ; also sheet 3
MOTB1-2_!FAULT!: MOTB1-2.18(!FAULT!) ; also sheet 2,3
MOTB1-2_!SLEEP!: MOTB1-2.17(!SLEEP!)
MOTB1-2_DECAY: MOTB1-2.19(DECAY)
MOTB1_DIR: MOTB1-2.20(AIN2)
MOTB1_OUT+: MOTB1-2.5(AOUT1)
MOTB1_OUT-: MOTB1-2.7(AOUT2)
MOTB1_PWM: MOTB1-2.21(AIN1) ; also sheet 3
MOTB2_DIR: MOTB1-2.23(BIN2)
MOTB2_OUT+: MOTB1-2.10(BOUT1)
MOTB2_OUT-: MOTB1-2.8(BOUT2)
MOTB2_PWM: MOTB1-2.22(BIN1) ; also sheet 3
MOTB3-4_!FAULT!: MOTB3-4.18(!FAULT!) ; also sheet 2,3
MOTB3-4_!SLEEP!: MOTB3-4.17(!SLEEP!)
MOTB3-4_DECAY: MOTB3-4.19(DECAY)
MOTB3_DIR: MOTB3-4.20(AIN2)
MOTB3_OUT+: MOTB3-4.5(AOUT1)
MOTB3_OUT-: MOTB3-4.7(AOUT2)
MOTB3_PWM: MOTB3-4.21(AIN1) ; also sheet 3
MOTB4_DIR: MOTB3-4.23(BIN2)
MOTB4_OUT+: MOTB3-4.10(BOUT1)
MOTB4_OUT-: MOTB3-4.8(BOUT2)
MOTB4_PWM: MOTB3-4.22(BIN1) ; also sheet 3
N$5: CP3.1 MOTA2.1(CP1)
N$18: CP3.2 MOTA2.2(CP2)
N$19: CP1.1 MOTA1.1(CP1)
N$20: CP1.2 MOTA1.2(CP2)
N$21: CP2.2 MOTA1.3(VCP)
N$22: CB23.1 MOTA1.12(VREF) MOTA1.13(VREF) MOTA1.15(V3P3OUT)
N$23: CP4.2 MOTA2.3(VCP)
N$24: CB24.1 MOTA2.12(VREF) MOTA2.13(VREF) MOTA2.15(V3P3OUT)
N$25: CP5.1 MOTA3.1(CP1)
N$26: CP5.2 MOTA3.2(CP2)
N$27: CP6.2 MOTA3.3(VCP)
N$28: CB25.1 MOTA3.12(VREF) MOTA3.13(VREF) MOTA3.15(V3P3OUT)
N$29: CP7.2 MOTB1-2.2(CP2)
N$30: CP7.1 MOTB1-2.1(CP1)
N$31: CP8.2 MOTB1-2.3(VCP)
N$32: CB26.1 MOTB1-2.12(AVREF) MOTB1-2.13(BVREF) MOTB1-2.15(V3P3OUT)
N$33: CP9.2 MOTB3-4.2(CP2)
N$34: CP9.1 MOTB3-4.1(CP1)
N$35: CP10.2 MOTB3-4.3(VCP)
N$36: CB27.1 MOTB3-4.12(AVREF) MOTB3-4.13(BVREF) MOTB3-4.15(V3P3OUT)
SENSE_IMOTA1: MOTA1.6(ISEN) MOTA1.9(ISEN) R18.1 ; also sheet 3
SENSE_IMOTA2: MOTA2.6(ISEN) MOTA2.9(ISEN) R19.1 ; also sheet 3
SENSE_IMOTA3: MOTA3.6(ISEN) MOTA3.9(ISEN) R20.1 ; also sheet 3
SENSE_IMOTB1: MOTB1-2.6(ISENA) R21.1 ; also sheet 3
SENSE_IMOTB2: MOTB1-2.9(ISENB) R22.1 ; also sheet 3
SENSE_IMOTB3: MOTB3-4.6(ISENA) R23.1 ; also sheet 3
SENSE_IMOTB4: MOTB3-4.9(ISENB) R24.1 ; also sheet 3
Unconnected: MOTB1-2.24(AI0) MOTB1-2.25(AI1) MOTB1-2.26(BI0) MOTB1-2.27(BI1) MOTB3-4.24(AI0) MOTB3-4.25(AI1) MOTB3-4.26(BI0) MOTB3-4.27(BI1)

### Notes on the sheet
- 3 x Type A Motors (main), 5A | 4 x Type B Motors (auxilliary), 3A
- Supplied straight from battery (+VP) | Supplied from +VP3 or +VP4 (2 of each)
- Shunt resistors are 2 x 0.27; 2W (stacked) | Ichop_max = Vref / (5 x RIsense) = 3.3 / (5 x 0.27) = 2.4A
- Ichop_max = Vref / (5 x RIsense) = 3.3 / (5 x 0.135) = 4.8A | PRmax = R x I² = 0.27 x 2.4² = 1.55W < 2W
- PRmax = R x I² = 0.135 x 4.8² = 3.1W < 4W

## Sheet 6 of 8: Quadrature encoders
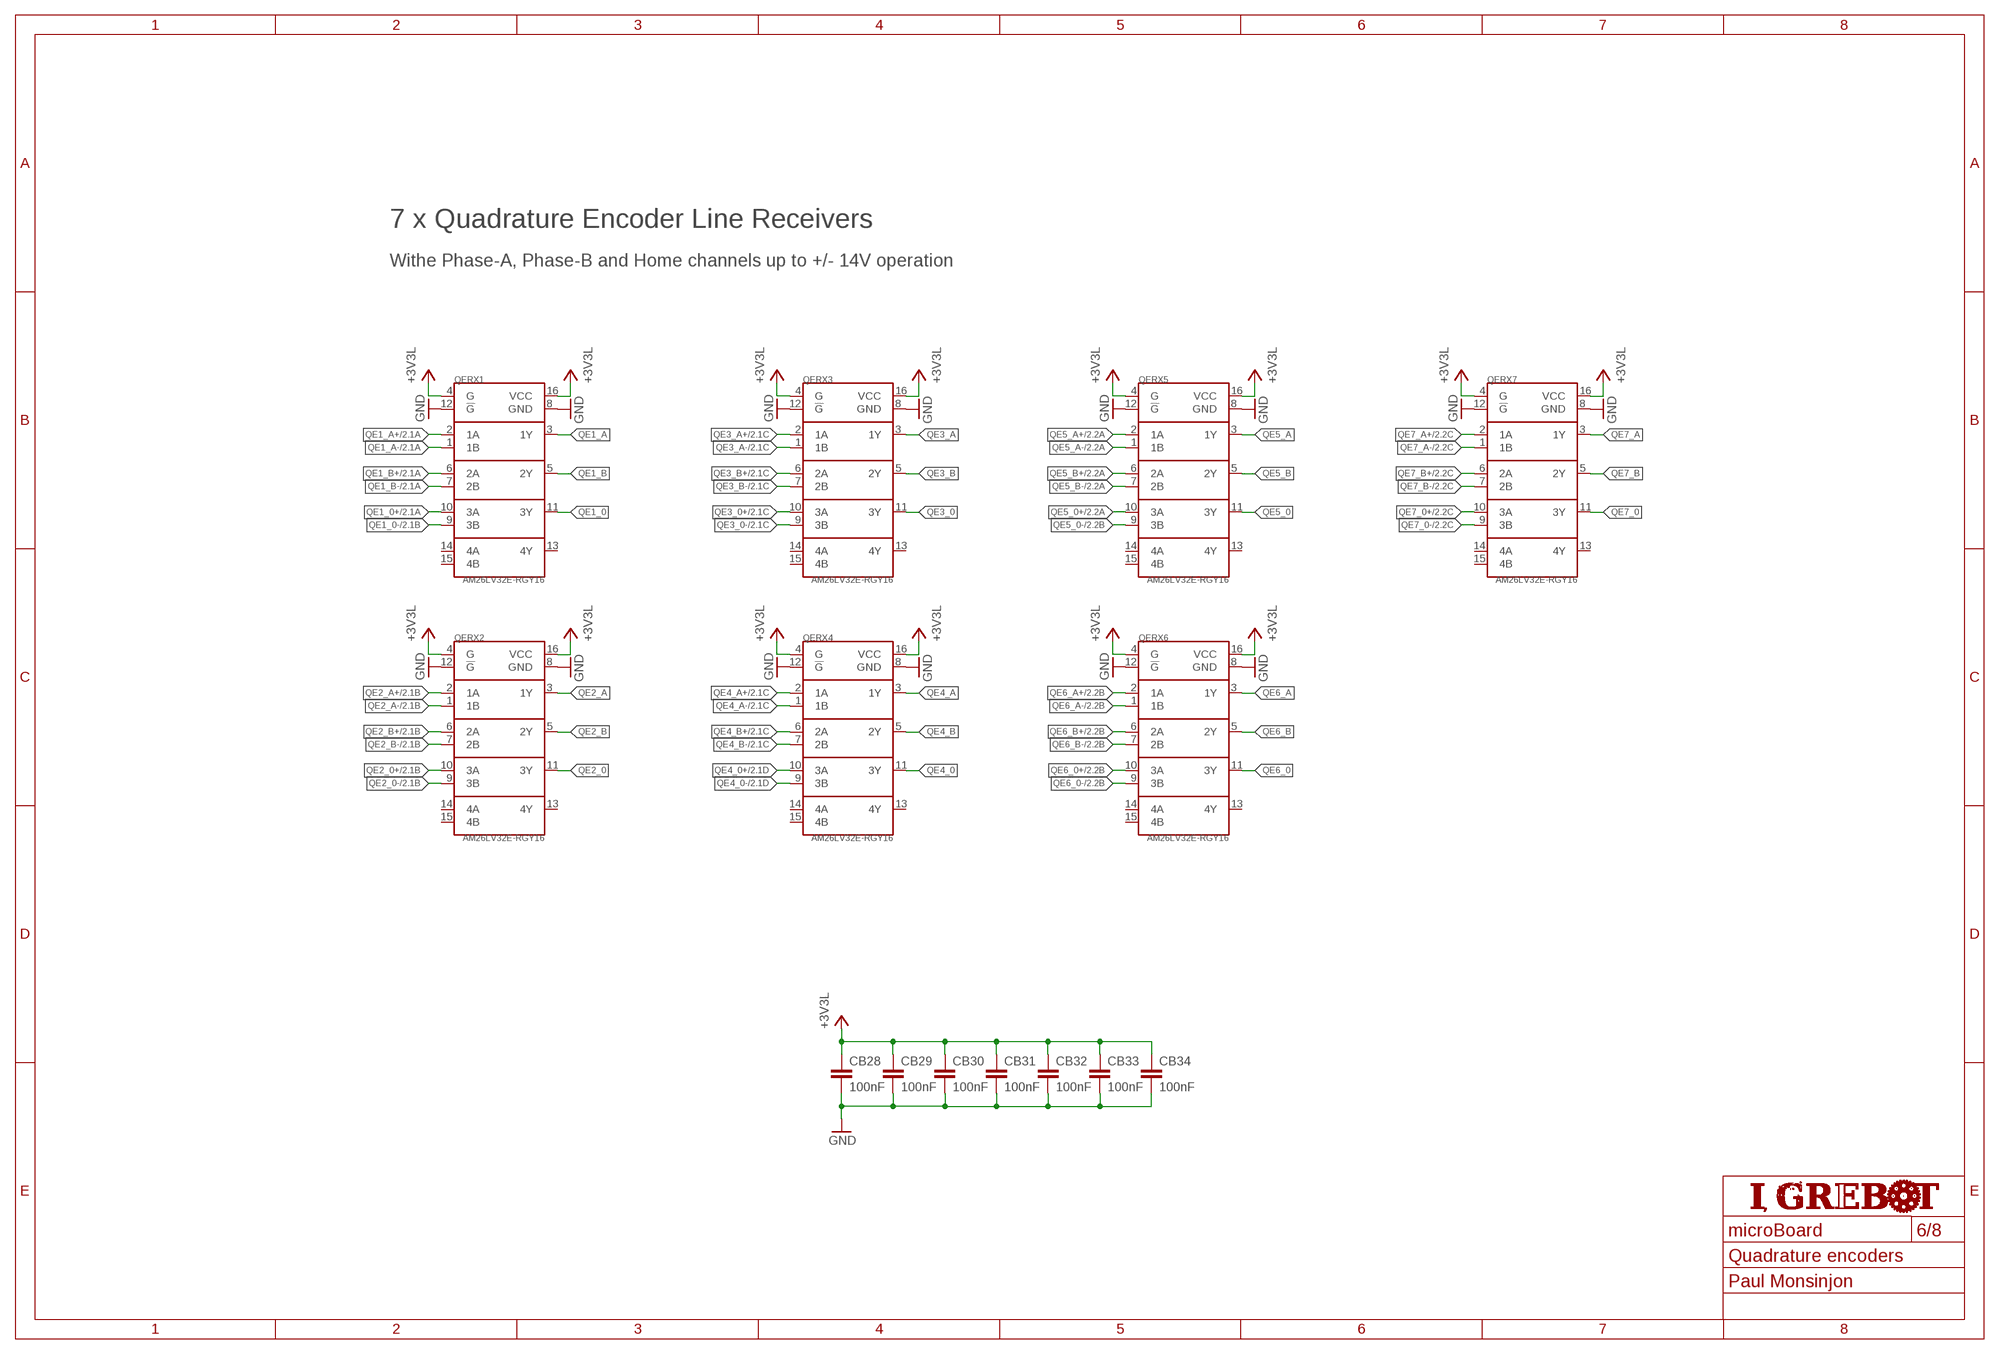
[diagram p5: schematic, sheet 6]
U$6 (FRAME_A3): AUTHOR: Paul Monsinjon; SHEET_NAME: Quadrature encoders

### Parts
CB28  100nF  C-EUC0603  [C0603]
CB29  100nF  C-EUC0603  [C0603]
CB30  100nF  C-EUC0603  [C0603]
CB31  100nF  C-EUC0603  [C0603]
CB32  100nF  C-EUC0603  [C0603]
CB33  100nF  C-EUC0603  [C0603]
CB34  100nF  C-EUC0603  [C0603]
QERX1  AM26LV32E-RGY16  [RGY_16]
QERX2  AM26LV32E-RGY16  [RGY_16]
QERX3  AM26LV32E-RGY16  [RGY_16]
QERX4  AM26LV32E-RGY16  [RGY_16]
QERX5  AM26LV32E-RGY16  [RGY_16]
QERX6  AM26LV32E-RGY16  [RGY_16]
QERX7  AM26LV32E-RGY16  [RGY_16]

### Nets
+3V3L: CB28.1 CB29.1 CB30.1 CB31.1 CB32.1 CB33.1 CB34.1 QERX1.4(G) QERX1.16(VCC) QERX2.4(G) QERX2.16(VCC) QERX3.4(G) QERX3.16(VCC) QERX4.4(G) QERX4.16(VCC) QERX5.4(G) QERX5.16(VCC) QERX6.4(G) QERX6.16(VCC) QERX7.4(G) QERX7.16(VCC) ; also sheet 1,2,3,4,5,7
GND: CB28.2 CB29.2 CB30.2 CB31.2 CB32.2 CB33.2 CB34.2 QERX1.8(GND) QERX1.12(!G!) QERX2.8(GND) QERX2.12(!G!) QERX3.8(GND) QERX3.12(!G!) QERX4.8(GND) QERX4.12(!G!) QERX5.8(GND) QERX5.12(!G!) QERX6.8(GND) QERX6.12(!G!) QERX7.8(GND) QERX7.12(!G!) ; also sheet 1,2,3,4,5,7
QE1_0: QERX1.11(3Y)
QE1_0+: QERX1.10(3A) ; also sheet 2
QE1_0-: QERX1.9(3B) ; also sheet 2
QE1_A: QERX1.3(1Y)
QE1_A+: QERX1.2(1A) ; also sheet 2
QE1_A-: QERX1.1(1B) ; also sheet 2
QE1_B: QERX1.5(2Y)
QE1_B+: QERX1.6(2A) ; also sheet 2
QE1_B-: QERX1.7(2B) ; also sheet 2
QE2_0: QERX2.11(3Y)
QE2_0+: QERX2.10(3A) ; also sheet 2
QE2_0-: QERX2.9(3B) ; also sheet 2
QE2_A: QERX2.3(1Y)
QE2_A+: QERX2.2(1A) ; also sheet 2
QE2_A-: QERX2.1(1B) ; also sheet 2
QE2_B: QERX2.5(2Y)
QE2_B+: QERX2.6(2A) ; also sheet 2
QE2_B-: QERX2.7(2B) ; also sheet 2
QE3_0: QERX3.11(3Y)
QE3_0+: QERX3.10(3A) ; also sheet 2
QE3_0-: QERX3.9(3B) ; also sheet 2
QE3_A: QERX3.3(1Y)
QE3_A+: QERX3.2(1A) ; also sheet 2
QE3_A-: QERX3.1(1B) ; also sheet 2
QE3_B: QERX3.5(2Y)
QE3_B+: QERX3.6(2A) ; also sheet 2
QE3_B-: QERX3.7(2B) ; also sheet 2
QE4_0: QERX4.11(3Y)
QE4_0+: QERX4.10(3A) ; also sheet 2
QE4_0-: QERX4.9(3B) ; also sheet 2
QE4_A: QERX4.3(1Y)
QE4_A+: QERX4.2(1A) ; also sheet 2
QE4_A-: QERX4.1(1B) ; also sheet 2
QE4_B: QERX4.5(2Y)
QE4_B+: QERX4.6(2A) ; also sheet 2
QE4_B-: QERX4.7(2B) ; also sheet 2
QE5_0: QERX5.11(3Y)
QE5_0+: QERX5.10(3A) ; also sheet 2
QE5_0-: QERX5.9(3B) ; also sheet 2
QE5_A: QERX5.3(1Y)
QE5_A+: QERX5.2(1A) ; also sheet 2
QE5_A-: QERX5.1(1B) ; also sheet 2
QE5_B: QERX5.5(2Y)
QE5_B+: QERX5.6(2A) ; also sheet 2
QE5_B-: QERX5.7(2B) ; also sheet 2
QE6_0: QERX6.11(3Y)
QE6_0+: QERX6.10(3A) ; also sheet 2
QE6_0-: QERX6.9(3B) ; also sheet 2
QE6_A: QERX6.3(1Y)
QE6_A+: QERX6.2(1A) ; also sheet 2
QE6_A-: QERX6.1(1B) ; also sheet 2
QE6_B: QERX6.5(2Y)
QE6_B+: QERX6.6(2A) ; also sheet 2
QE6_B-: QERX6.7(2B) ; also sheet 2
QE7_0: QERX7.11(3Y)
QE7_0+: QERX7.10(3A) ; also sheet 2
QE7_0-: QERX7.9(3B) ; also sheet 2
QE7_A: QERX7.3(1Y)
QE7_A+: QERX7.2(1A) ; also sheet 2
QE7_A-: QERX7.1(1B) ; also sheet 2
QE7_B: QERX7.5(2Y)
QE7_B+: QERX7.6(2A) ; also sheet 2
QE7_B-: QERX7.7(2B) ; also sheet 2
Unconnected: QERX1.13(4Y) QERX1.14(4A) QERX1.15(4B) QERX2.13(4Y) QERX2.14(4A) QERX2.15(4B) QERX3.13(4Y) QERX3.14(4A) QERX3.15(4B) QERX4.13(4Y) QERX4.14(4A) QERX4.15(4B) QERX5.13(4Y) QERX5.14(4A) QERX5.15(4B) QERX6.13(4Y) QERX6.14(4A) QERX6.15(4B) QERX7.13(4Y) QERX7.14(4A) QERX7.15(4B)

### Notes on the sheet
- 7 x Quadrature Encoder Line Receivers
- Withe Phase-A, Phase-B and Home channels up to +/- 14V operation

## Sheet 7 of 8: Optocouplers
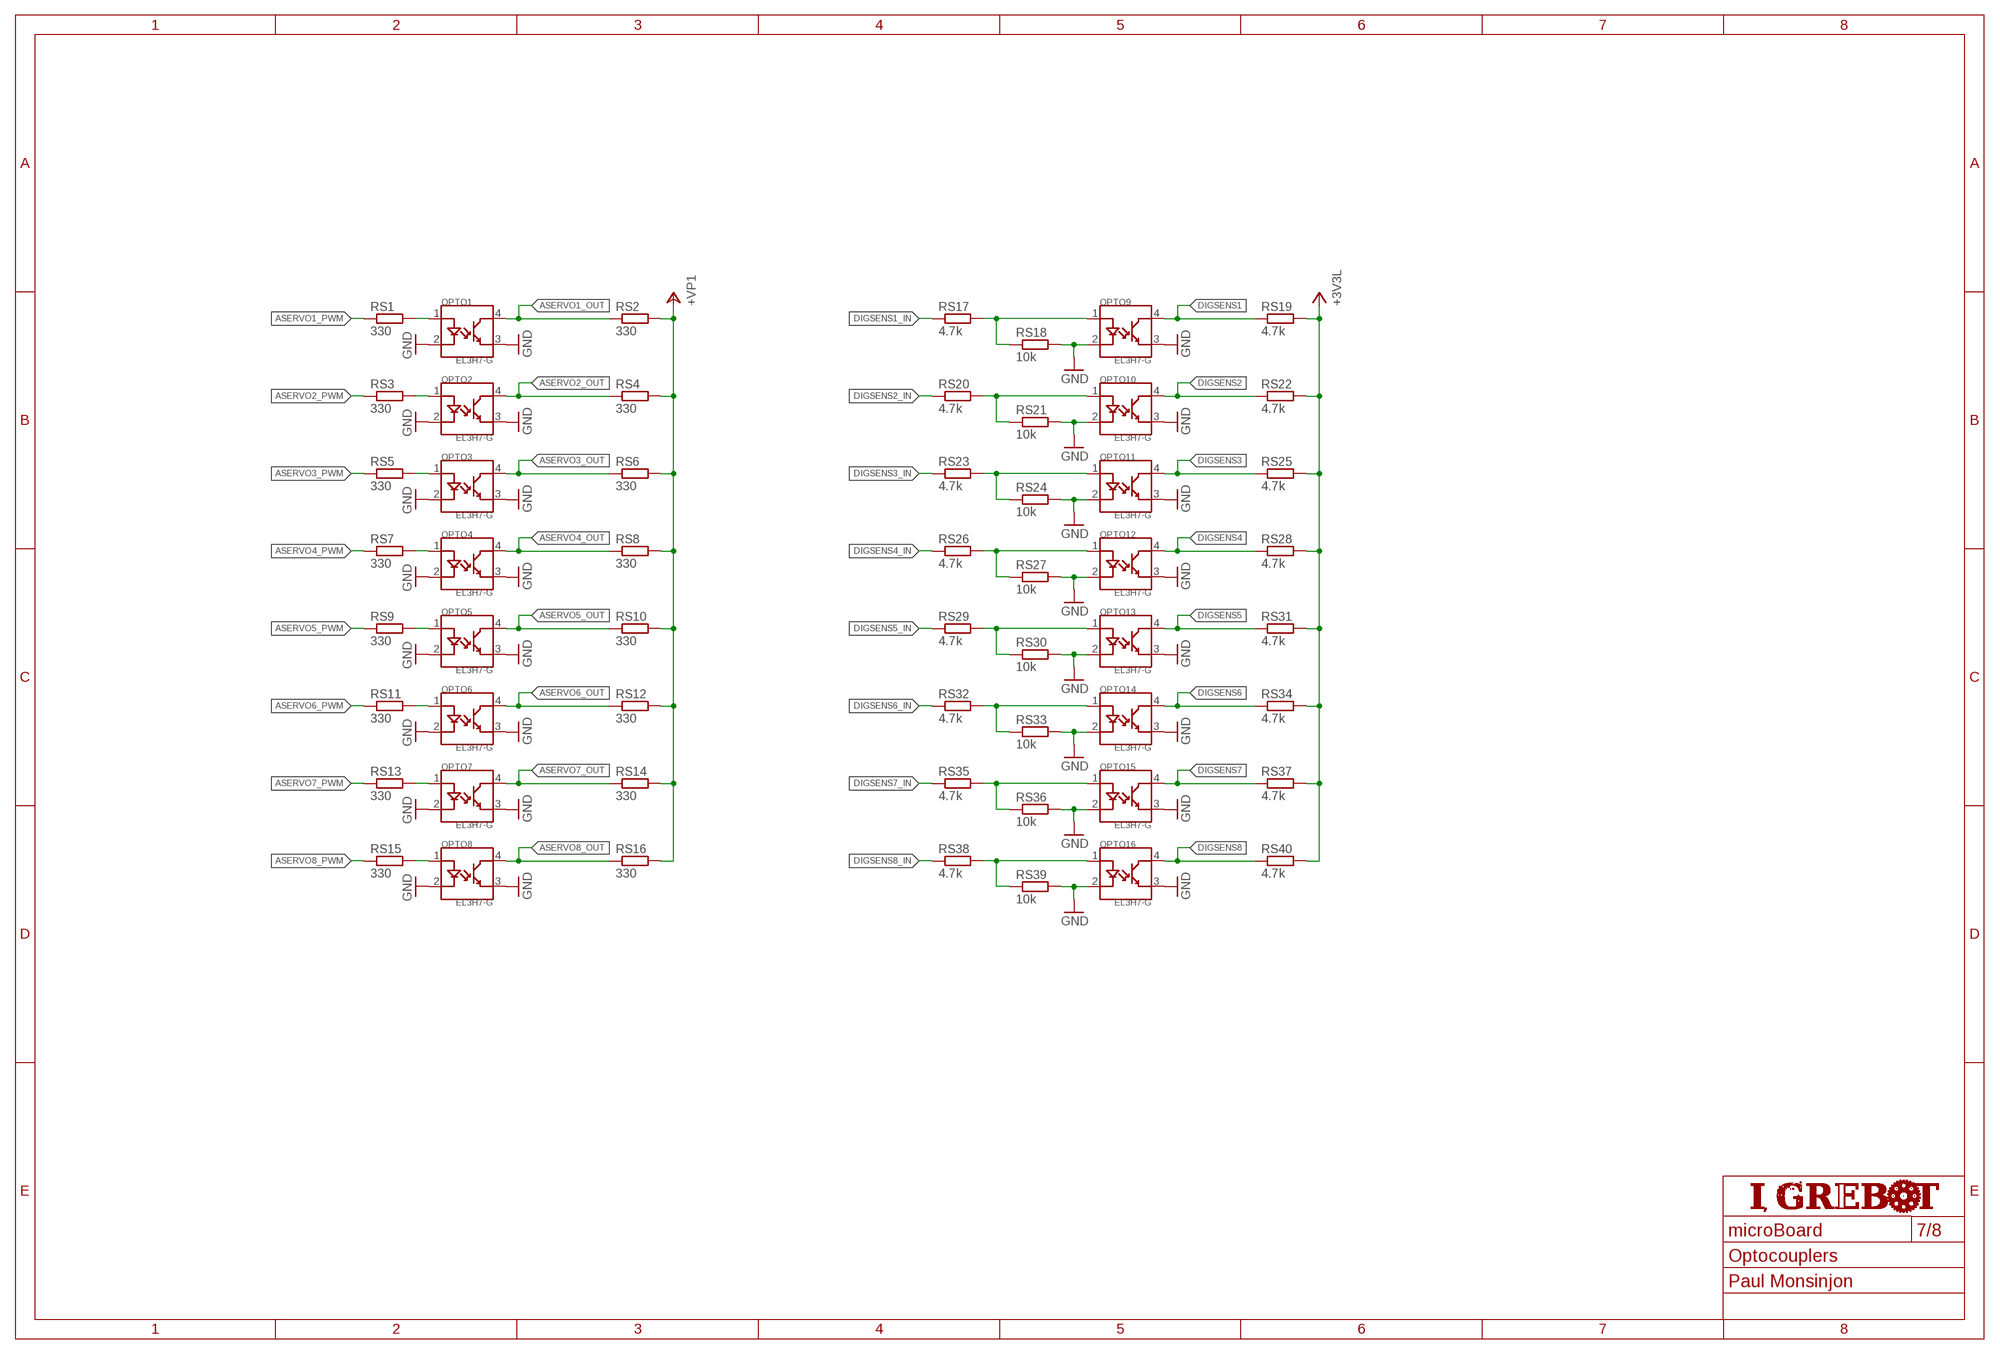
[diagram p6: schematic, sheet 7]
U$7 (FRAME_A3): AUTHOR: Paul Monsinjon; SHEET_NAME: Optocouplers

### Parts
OPTO1  EL3H7-G  [SSOP_4]
OPTO2  EL3H7-G  [SSOP_4]
OPTO3  EL3H7-G  [SSOP_4]
OPTO4  EL3H7-G  [SSOP_4]
OPTO5  EL3H7-G  [SSOP_4]
OPTO6  EL3H7-G  [SSOP_4]
OPTO7  EL3H7-G  [SSOP_4]
OPTO8  EL3H7-G  [SSOP_4]
OPTO9  EL3H7-G  [SSOP_4]
OPTO10  EL3H7-G  [SSOP_4]
OPTO11  EL3H7-G  [SSOP_4]
OPTO12  EL3H7-G  [SSOP_4]
OPTO13  EL3H7-G  [SSOP_4]
OPTO14  EL3H7-G  [SSOP_4]
OPTO15  EL3H7-G  [SSOP_4]
OPTO16  EL3H7-G  [SSOP_4]
RS1  330  R-EU_R0603  [R0603]
RS2  330  R-EU_R0603  [R0603]
RS3  330  R-EU_R0603  [R0603]
RS4  330  R-EU_R0603  [R0603]
RS5  330  R-EU_R0603  [R0603]
RS6  330  R-EU_R0603  [R0603]
RS7  330  R-EU_R0603  [R0603]
RS8  330  R-EU_R0603  [R0603]
RS9  330  R-EU_R0603  [R0603]
RS10  330  R-EU_R0603  [R0603]
RS11  330  R-EU_R0603  [R0603]
RS12  330  R-EU_R0603  [R0603]
RS13  330  R-EU_R0603  [R0603]
RS14  330  R-EU_R0603  [R0603]
RS15  330  R-EU_R0603  [R0603]
RS16  330  R-EU_R0603  [R0603]
RS17  4.7k  R-EU_R0603  [R0603]
RS18  10k  R-EU_R0603  [R0603]
RS19  4.7k  R-EU_R0603  [R0603]
RS20  4.7k  R-EU_R0603  [R0603]
RS21  10k  R-EU_R0603  [R0603]
RS22  4.7k  R-EU_R0603  [R0603]
RS23  4.7k  R-EU_R0603  [R0603]
RS24  10k  R-EU_R0603  [R0603]
RS25  4.7k  R-EU_R0603  [R0603]
RS26  4.7k  R-EU_R0603  [R0603]
RS27  10k  R-EU_R0603  [R0603]
RS28  4.7k  R-EU_R0603  [R0603]
RS29  4.7k  R-EU_R0603  [R0603]
RS30  10k  R-EU_R0603  [R0603]
RS31  4.7k  R-EU_R0603  [R0603]
RS32  4.7k  R-EU_R0603  [R0603]
RS33  10k  R-EU_R0603  [R0603]
RS34  4.7k  R-EU_R0603  [R0603]
RS35  4.7k  R-EU_R0603  [R0603]
RS36  10k  R-EU_R0603  [R0603]
RS37  4.7k  R-EU_R0603  [R0603]
RS38  4.7k  R-EU_R0603  [R0603]
RS39  10k  R-EU_R0603  [R0603]
RS40  4.7k  R-EU_R0603  [R0603]

### Nets
+3V3L: RS19.2 RS22.2 RS25.2 RS28.2 RS31.2 RS34.2 RS37.2 RS40.2 ; also sheet 1,2,3,4,5,6
+VP1: RS2.2 RS4.2 RS6.2 RS8.2 RS10.2 RS12.2 RS14.2 RS16.2 ; also sheet 1
ASERVO1_OUT: OPTO1.4 RS2.1
ASERVO1_PWM: RS1.1
ASERVO2_OUT: OPTO2.4 RS4.1
ASERVO2_PWM: RS3.1
ASERVO3_OUT: OPTO3.4 RS6.1
ASERVO3_PWM: RS5.1
ASERVO4_OUT: OPTO4.4 RS8.1
ASERVO4_PWM: RS7.1
ASERVO5_OUT: OPTO5.4 RS10.1
ASERVO5_PWM: RS9.1
ASERVO6_OUT: OPTO6.4 RS12.1
ASERVO6_PWM: RS11.1
ASERVO7_OUT: OPTO7.4 RS14.1
ASERVO7_PWM: RS13.1
ASERVO8_OUT: OPTO8.4 RS16.1
ASERVO8_PWM: RS15.1
DIGSENS1: OPTO9.4 RS19.1
DIGSENS1_IN: RS17.1
DIGSENS2: OPTO10.4 RS22.1
DIGSENS2_IN: RS20.1
DIGSENS3: OPTO11.4 RS25.1
DIGSENS3_IN: RS23.1
DIGSENS4: OPTO12.4 RS28.1
DIGSENS4_IN: RS26.1
DIGSENS5: OPTO13.4 RS31.1
DIGSENS5_IN: RS29.1
DIGSENS6: OPTO14.4 RS34.1
DIGSENS6_IN: RS32.1
DIGSENS7: OPTO15.4 RS37.1
DIGSENS7_IN: RS35.1
DIGSENS8: OPTO16.4 RS40.1
DIGSENS8_IN: RS38.1
GND: OPTO1.2 OPTO1.3 OPTO2.2 OPTO2.3 OPTO3.2 OPTO3.3 OPTO4.2 OPTO4.3 OPTO5.2 OPTO5.3 OPTO6.2 OPTO6.3 OPTO7.2 OPTO7.3 OPTO8.2 OPTO8.3 OPTO9.2 OPTO9.3 OPTO10.2 OPTO10.3 OPTO11.2 OPTO11.3 OPTO12.2 OPTO12.3 OPTO13.2 OPTO13.3 OPTO14.2 OPTO14.3 OPTO15.2 OPTO15.3 OPTO16.2 OPTO16.3 RS18.2 RS21.2 RS24.2 RS27.2 RS30.2 RS33.2 RS36.2 RS39.2 ; also sheet 1,2,3,4,5,6
N$38: OPTO1.1 RS1.2
N$43: OPTO2.1 RS3.2
N$44: OPTO3.1 RS5.2
N$45: OPTO4.1 RS7.2
N$46: OPTO5.1 RS9.2
N$47: OPTO6.1 RS11.2
N$48: OPTO7.1 RS13.2
N$49: OPTO8.1 RS15.2
N$50: OPTO9.1 RS17.2 RS18.1
N$52: OPTO11.1 RS23.2 RS24.1
N$53: OPTO10.1 RS20.2 RS21.1
N$54: OPTO12.1 RS26.2 RS27.1
N$55: OPTO13.1 RS29.2 RS30.1
N$56: OPTO14.1 RS32.2 RS33.1
N$57: OPTO15.1 RS35.2 RS36.1
N$58: OPTO16.1 RS38.2 RS39.1

## Sheet 8 of 8: ADC Interfaces
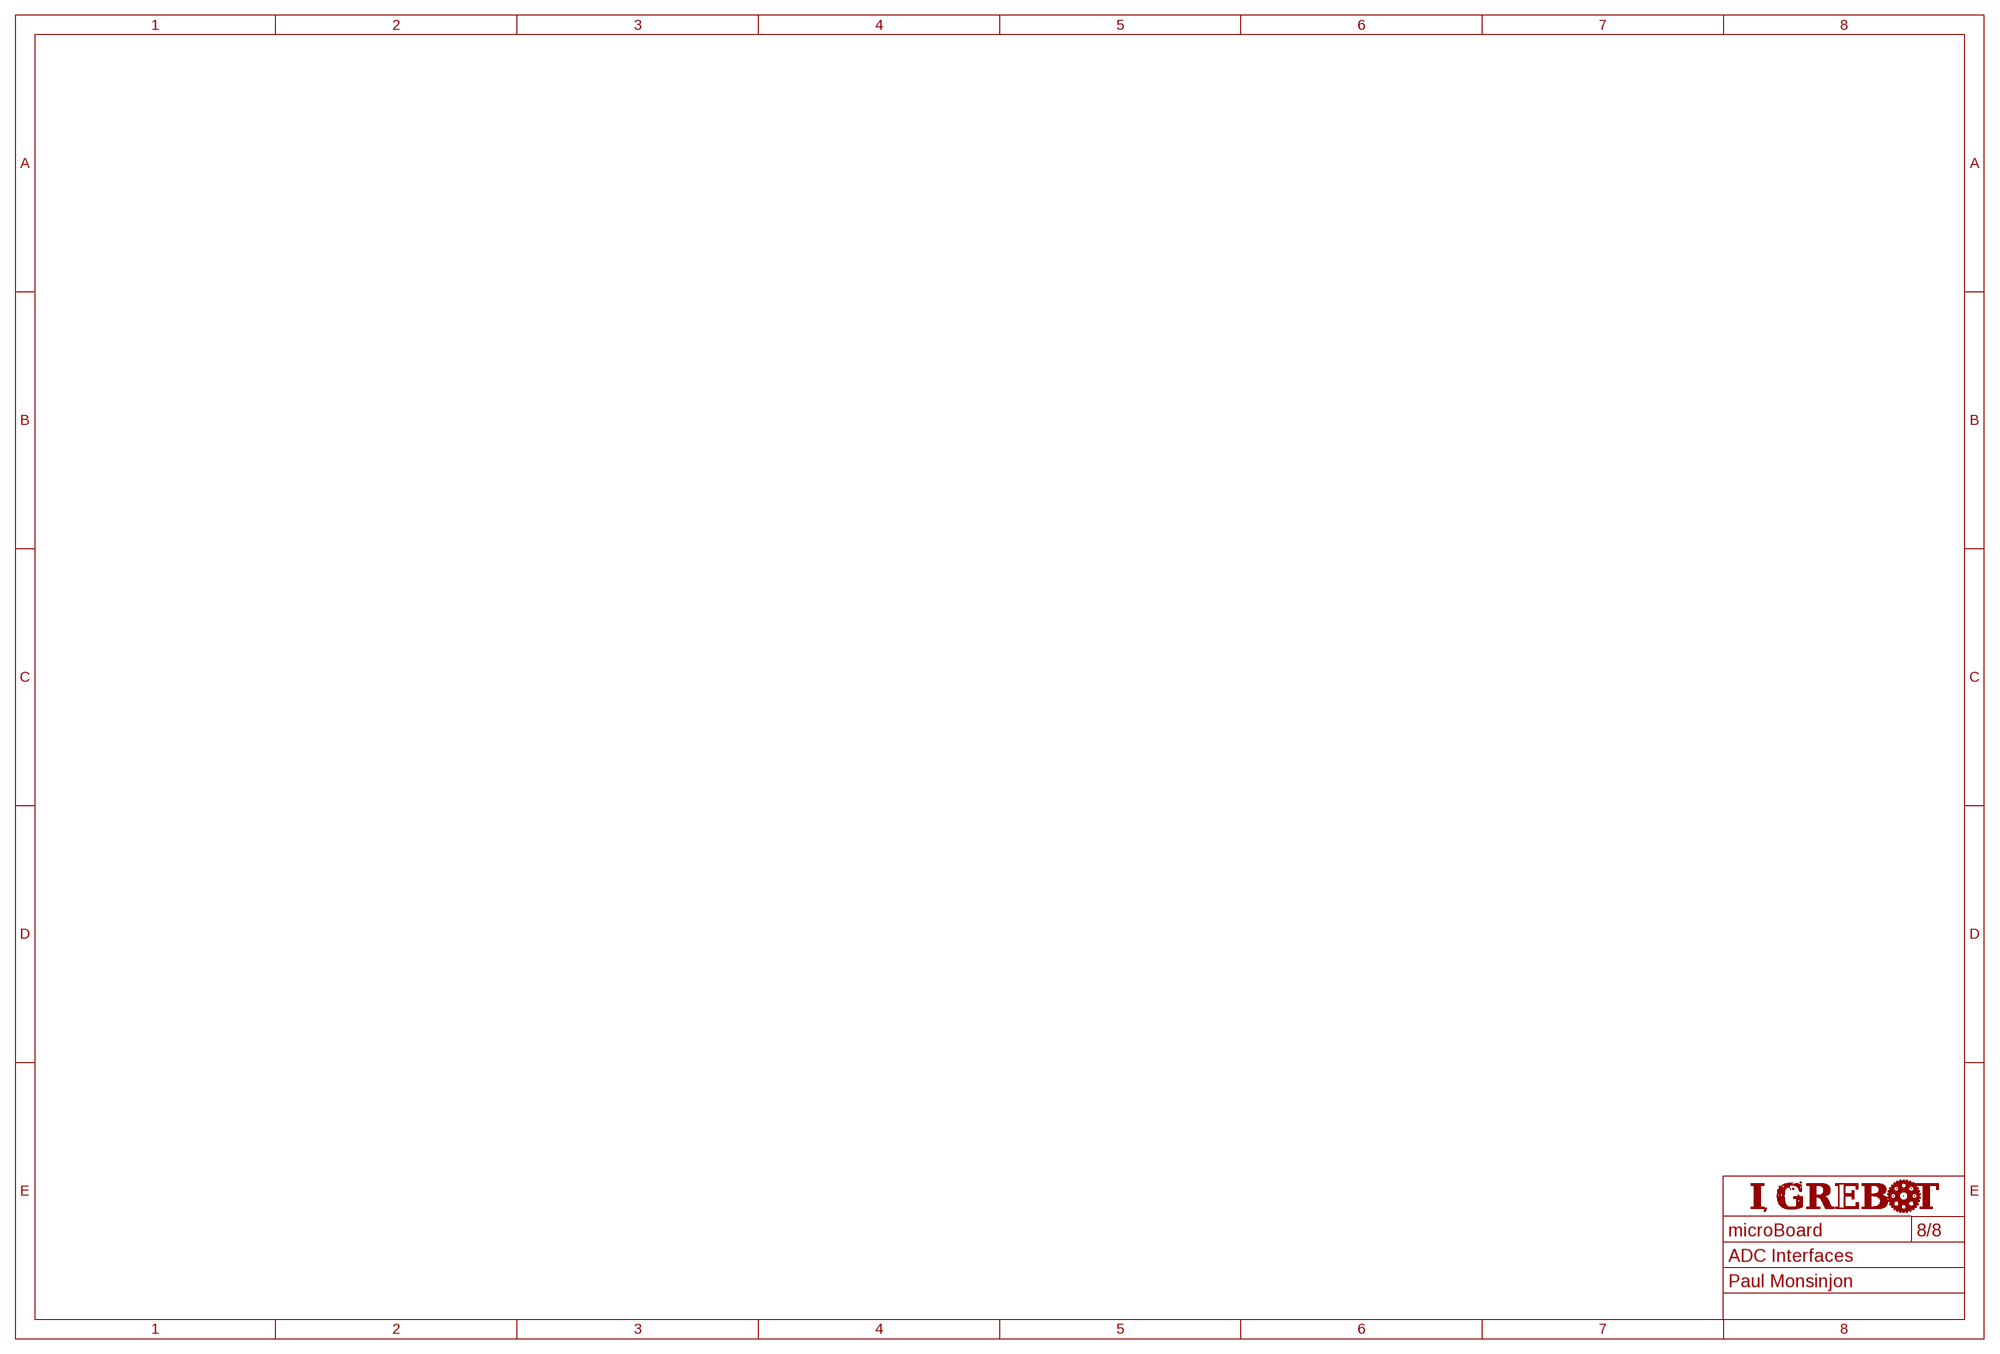
[diagram p7: schematic, sheet 8]
U$1 (FRAME_A3): AUTHOR: Paul Monsinjon; SHEET_NAME: ADC Interfaces

## Library data of the parts
1V2L = microLib:NX1117C
3V3L 5VL = microLib:LP38690DT
C1 C3-C5 C18 C19 C21 C23 C25 CT2-CT6 = rcl:CPOL-EU: POLARIZED CAPACITOR, European symbol
C2 C6-C17 C20 C22 C24 C26 CB1-CB34 CC1 CP1-CP10 CT1 CX1 CX2 = rcl:C-EU: CAPACITOR, European symbol
DSPIC = microLib:DSPIC33EP512MU814
FPGA = microLib:XC3S200A-VQ100
J1 = microLib:CON_1.27_4
L1-L3 = inductor-neosid:SM-B: INDUCTOR SMD Bead inductor; OC_FARNELL: unknown; OC_NEWARK: unknown
L4-L7 = inductors:DR1030: DR1030 Series Low Profile Power Inductors Source: Data sheet <http://www.cooperbussmann.com/pdf/c73e479f-f867-4c64-ae26-9c1f23814163.pdf>
LED1-LED6 = led:LED: LED OSRAM: - CHIPLED LG R971, LG N971, LY N971, LG Q971, LY Q971, LO R971, LY R971 LH N974, LH R974 LS Q976, LO Q976, LY Q976 LO Q996 - Hyper CHIPLED LW Q18S LB Q993, LB Q99A, LB R99A - SideLED LS A670, LO A670, LY A670, LG A670, LP A670 LB A673, LV A673, LT A673, LW A673 LH A674 LY A675 LS A676, LA A676, LO A676, LY A676, LW A676 LS A679, LY A679, LG A679 - Hyper Micro SIDELED® LS Y876, LA Y876, LO Y876, LY Y876 LT Y87S - SmartLED LW L88C, LW L88S LB L89C, LB L89S, LG L890 LS L89K, LO L89K, LY L89K LS L896, LA L896, LO L896, LY L896 - TOPLED LS T670, LO T670, LY T670, LG T670, LP T670 LSG T670, LSP T670, LSY T670, LOP T670, LYG T670 LG T671, LOG T671, LSG T671 LB T673, LV T673, LT T673, LW T673 LH T674 LS T676, LA T676, LO T676, LY T676, LB T676, LH T676, LSB T676, LW T676 LB T67C, LV T67C, LT T67C, LS T67K, LO T67K, LY T67K, LW E67C LS E67B, LA E67B, LO E67B, LY E67B, LB E67C, LV E67C, LT E67C LW T67C LS T679, LY T679, LG T679 LS T770, LO T770, LY T770, LG T770, LP T770 LB T773, LV T773, LT T773, LW T773 LH T774 LS E675, LA E675, LY E675, LS T675 LS T776, LA T776, LO T776, LY T776, LB T776 LHGB T686 LT T68C, LB T68C - Hyper Mini TOPLED® LB M676 - Mini TOPLED Santana® LG M470 LS M47K, LO M47K, LY M47K Source: http://www.osram.convergy.de LUXEON: - LUMILED® LXK2-PW12-R00, LXK2-PW12-S00, LXK2-PW14-U00, LXK2-PW14-V00 LXK2-PM12-R00, LXK2-PM12-S00, LXK2-PM14-U00 LXK2-PE12-Q00, LXK2-PE12-R00, LXK2-PE12-S00, LXK2-PE14-T00, LXK2-PE14-U00 LXK2-PB12-K00, LXK2-PB12-L00, LXK2-PB12-M00, LXK2-PB14-N00, LXK2-PB14-P00, LXK2-PB14-Q00 LXK2-PR12-L00, LXK2-PR12-M00, LXK2-PR14-Q00, LXK2-PR14-R00 LXK2-PD12-Q00, LXK2-PD12-R00, LXK2-PD12-S00 LXK2-PH12-R00, LXK2-PH12-S00 LXK2-PL12-P00, LXK2-PL12-Q00, LXK2-PL12-R00 Source: www.luxeon.com KINGBRIGHT: KA-3528ASYC Source: www.kingbright.com
MOTA1-MOTA3 = microLib:DRV8842
MOTB1-2 MOTB3-4 = microLib:DRV8843
OPTO1-OPTO16 = microLib:EL3H7-G
P1 P3 P5 P7 = resistor:R-TRIMM: Trimm resistor
QE1-QE7 = microLib:CON_1.27_8
QERX1-QERX7 = microLib:AM26LV32E-RGY16
R1-R24 = rcl:R-EU_: RESISTOR, European symbol
RL1-RL6 RS1-RS40 RU1-RU4 = resistor:R-EU_: RESISTOR, European symbol
SD_CARD = microLib:DM3AT-SF-PEJM5
SENSE_VL1 SENSE_VP1-SENSE_VP4 = microLib:INA138
U$8 = microLib:CON_1.25_4
VL1-VL3 = microLib:PTN78000W
VP1 VP2 = microLib:PTN78020W
VP3 VP4 = microLib:PTN78060W
X1 = crystal:CRYSTAL: CRYSTAL; OC_FARNELL: unknown; OC_NEWARK: unknown
X2 = SparkFun-FreqCtrl:OSCILLATOR: Generic 5x3 and 7x5 oscillators